# EasyEDA schematic SCH_8th-gen-Civic-Navigation-Screen-AIBT-Base.json

## Sheets
1 Power Inlet: TITLE: AIBT Base Power Inlet; REV: 1.0; Date: 2024-06-09; Sheet: 1/1; Drawn By: afranit; Company: Your Company
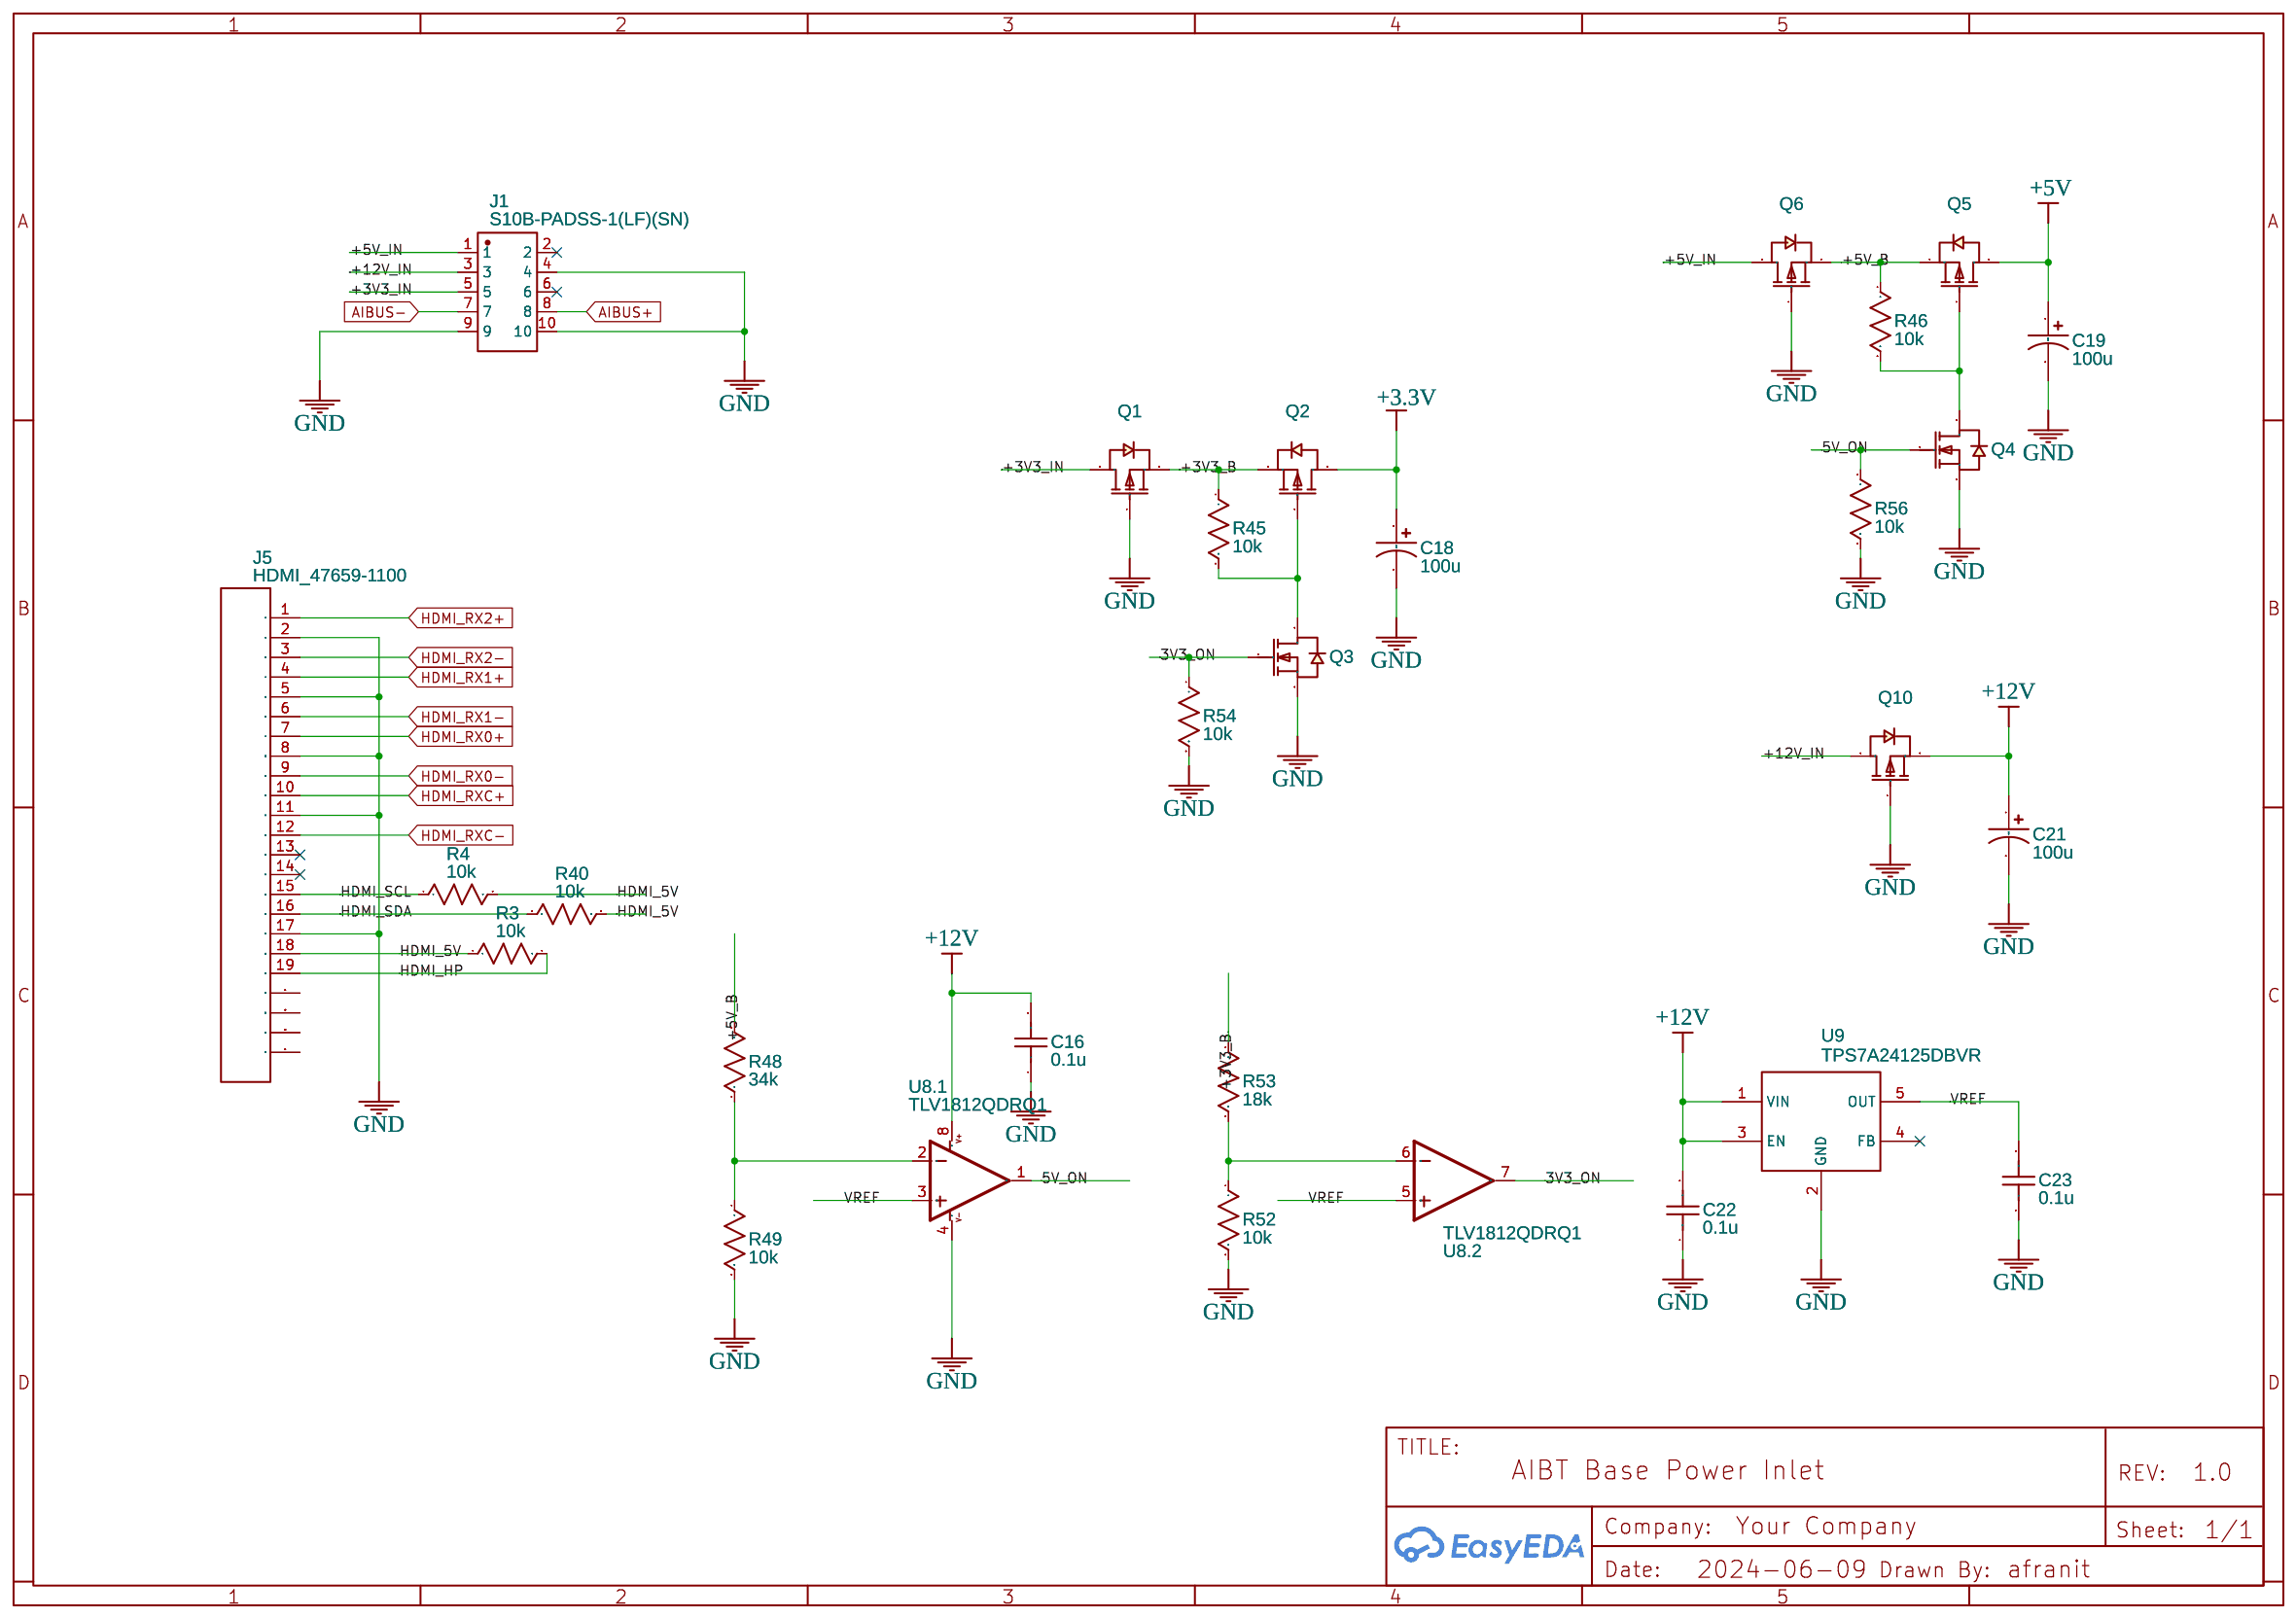
[diagram p0: Power Inlet]
2 Preregulator: TITLE: AIBT Base Preregulator; Date: 2024-07-02; Drawn By: Aidan C. Franits; Company: AidF Electronics
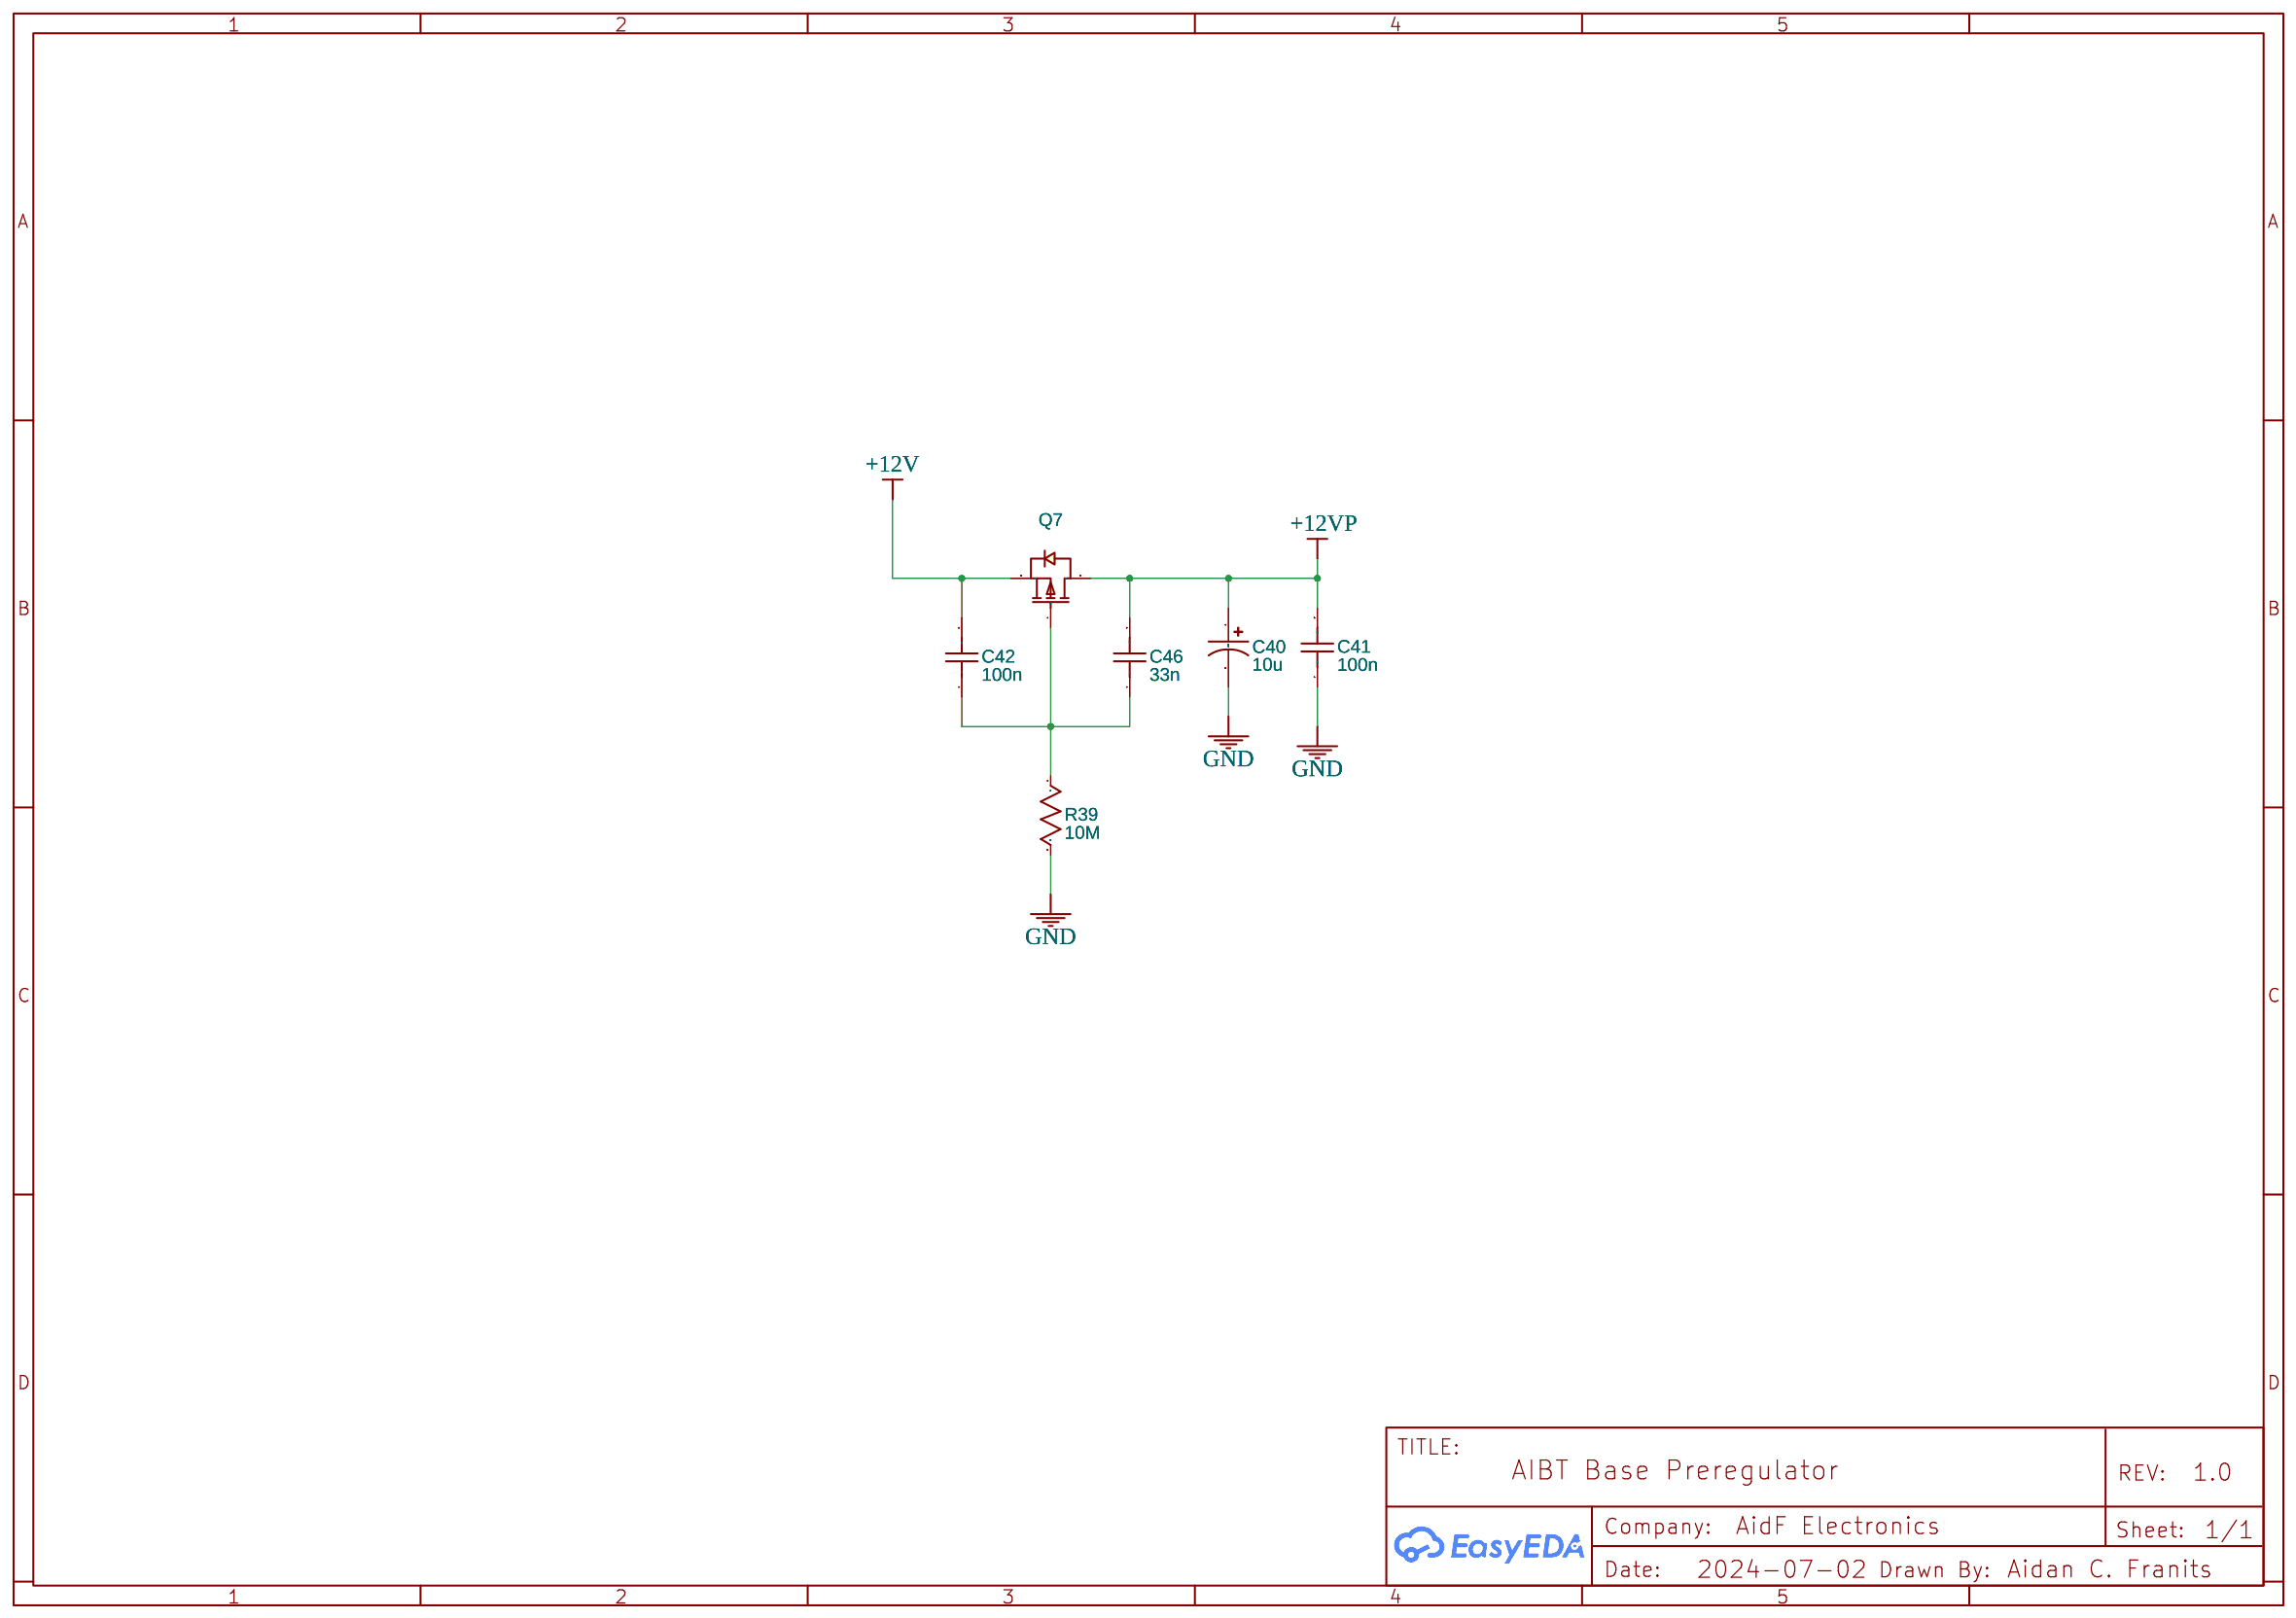
[diagram p1: Preregulator]
3 Power Conversion: TITLE: AIBT Base Power Conversion; Drawn By: Aidan C Franits; Company: AidF Electronics
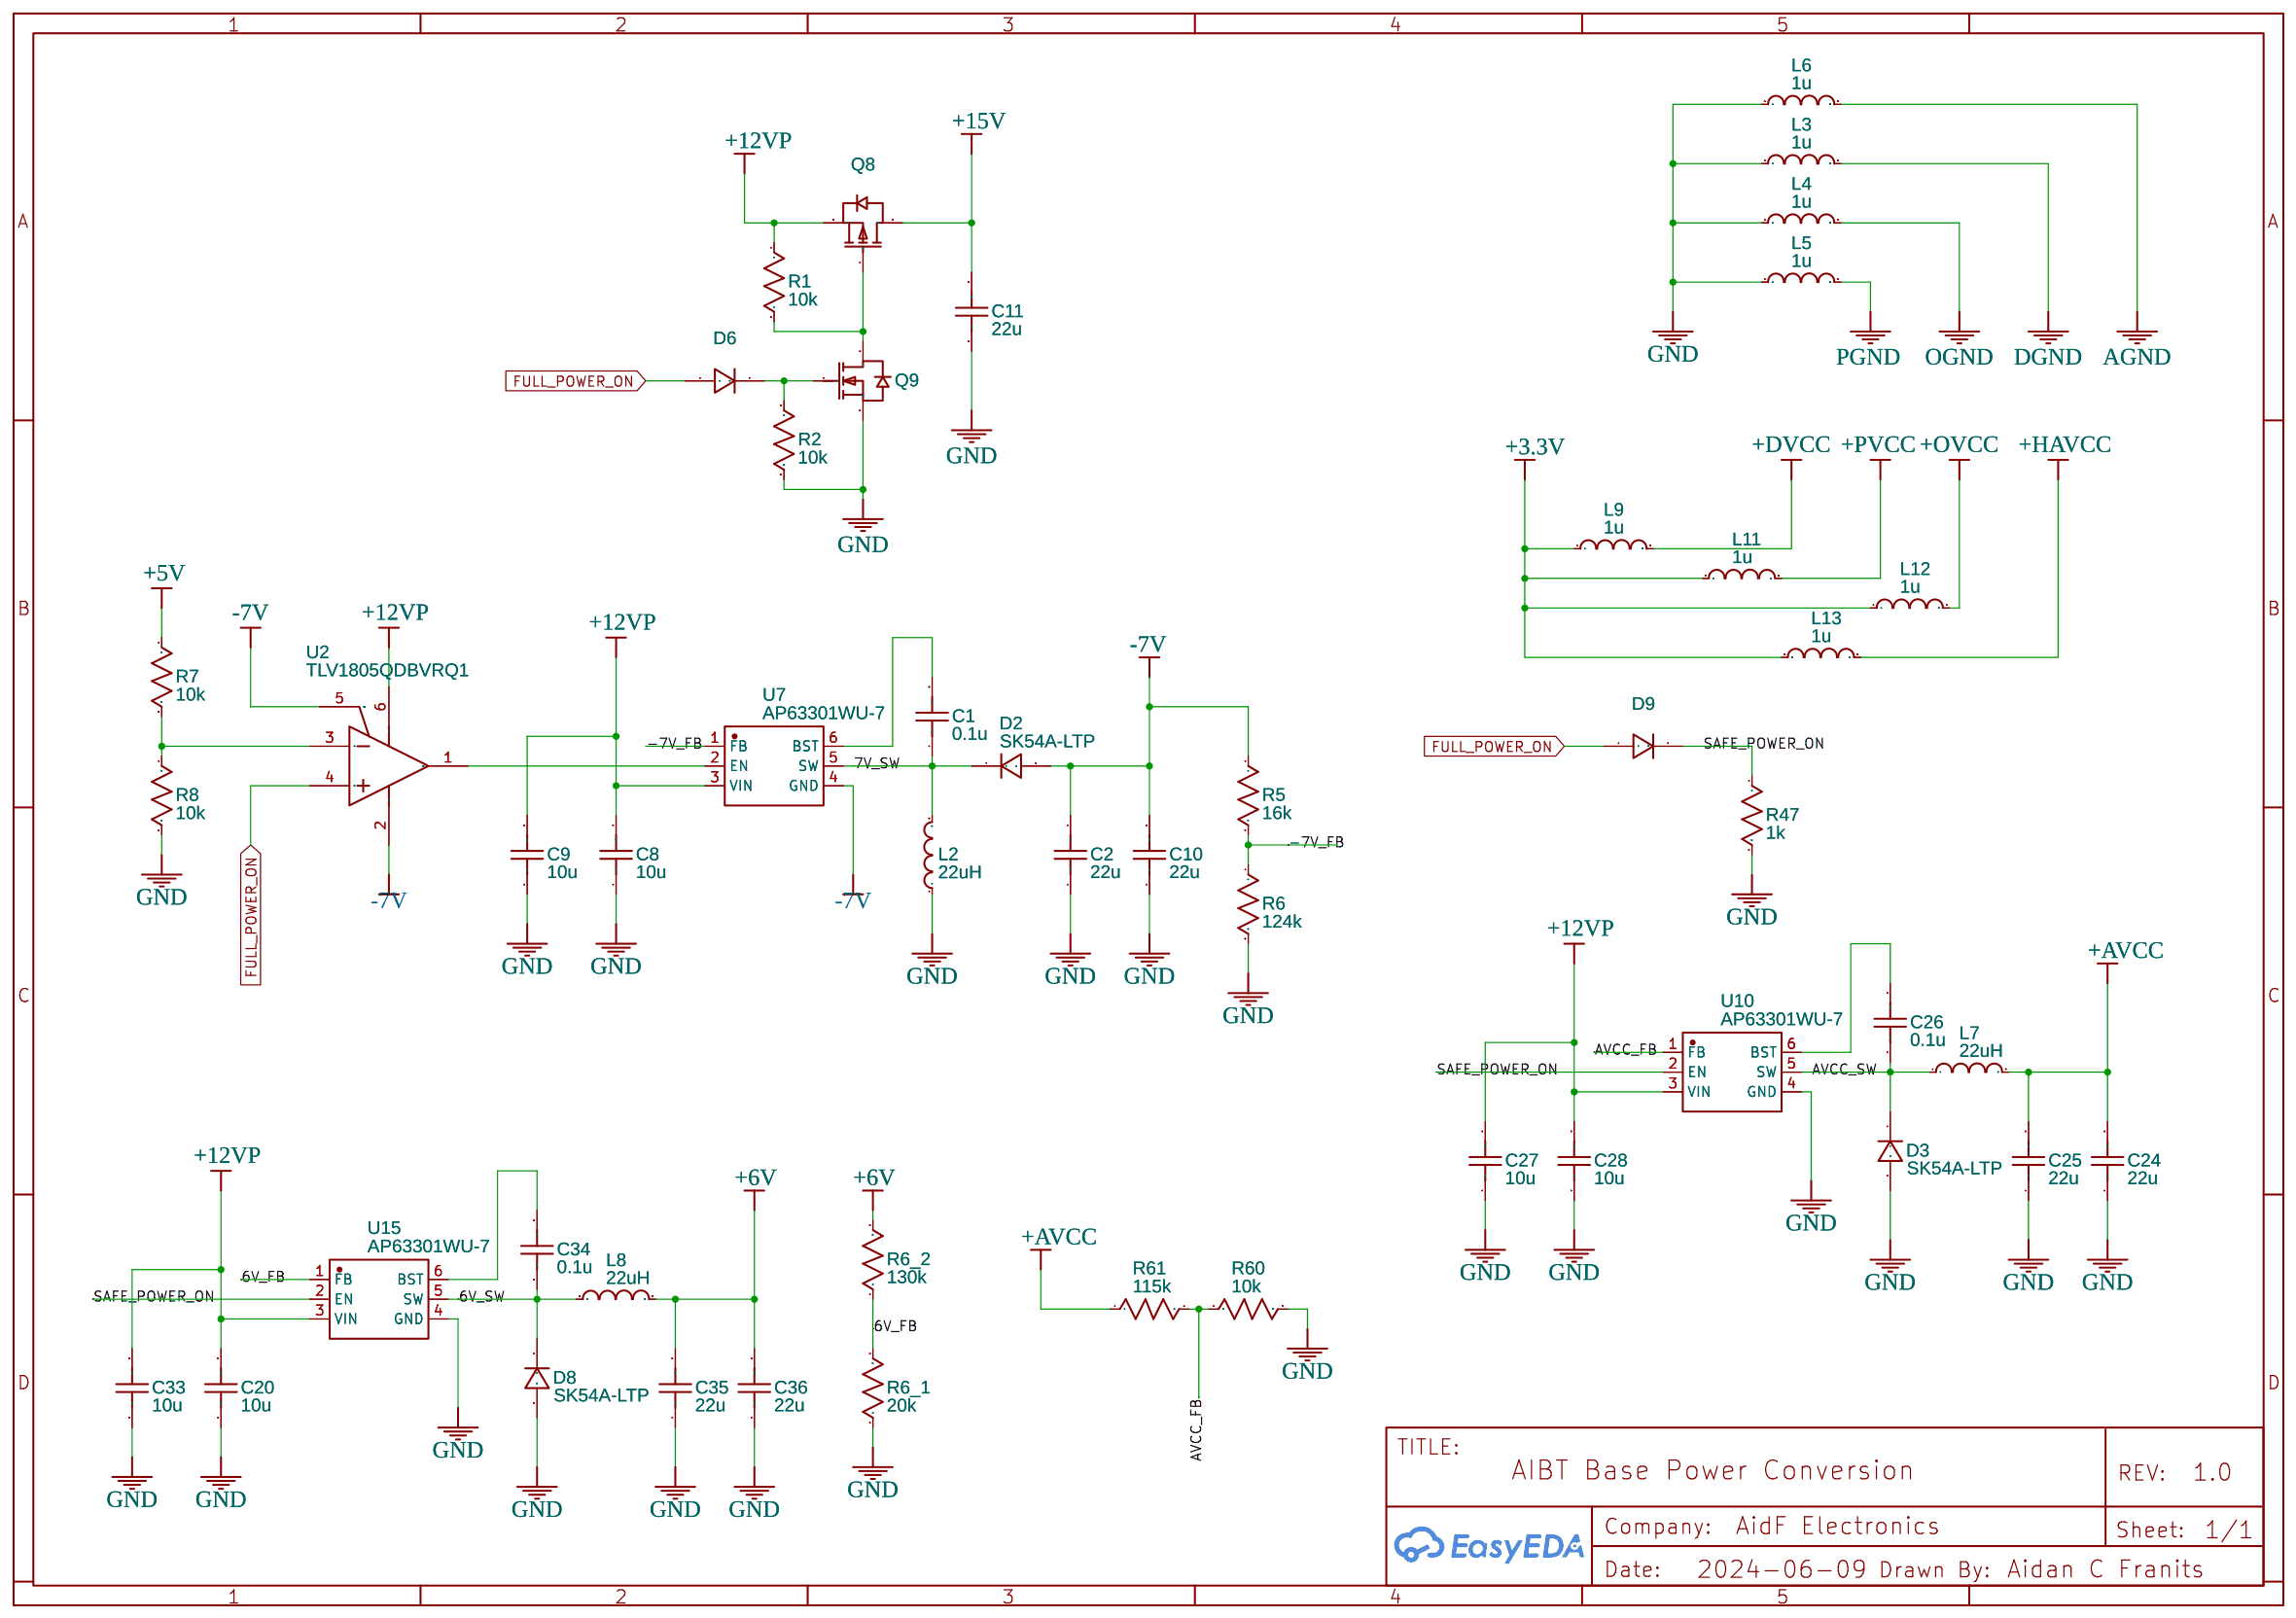
[diagram p2: Power Conversion]
4 Front Out: TITLE: AIBT Base Front Out; Drawn By: Aidan C Franits; Company: AidF Electronics
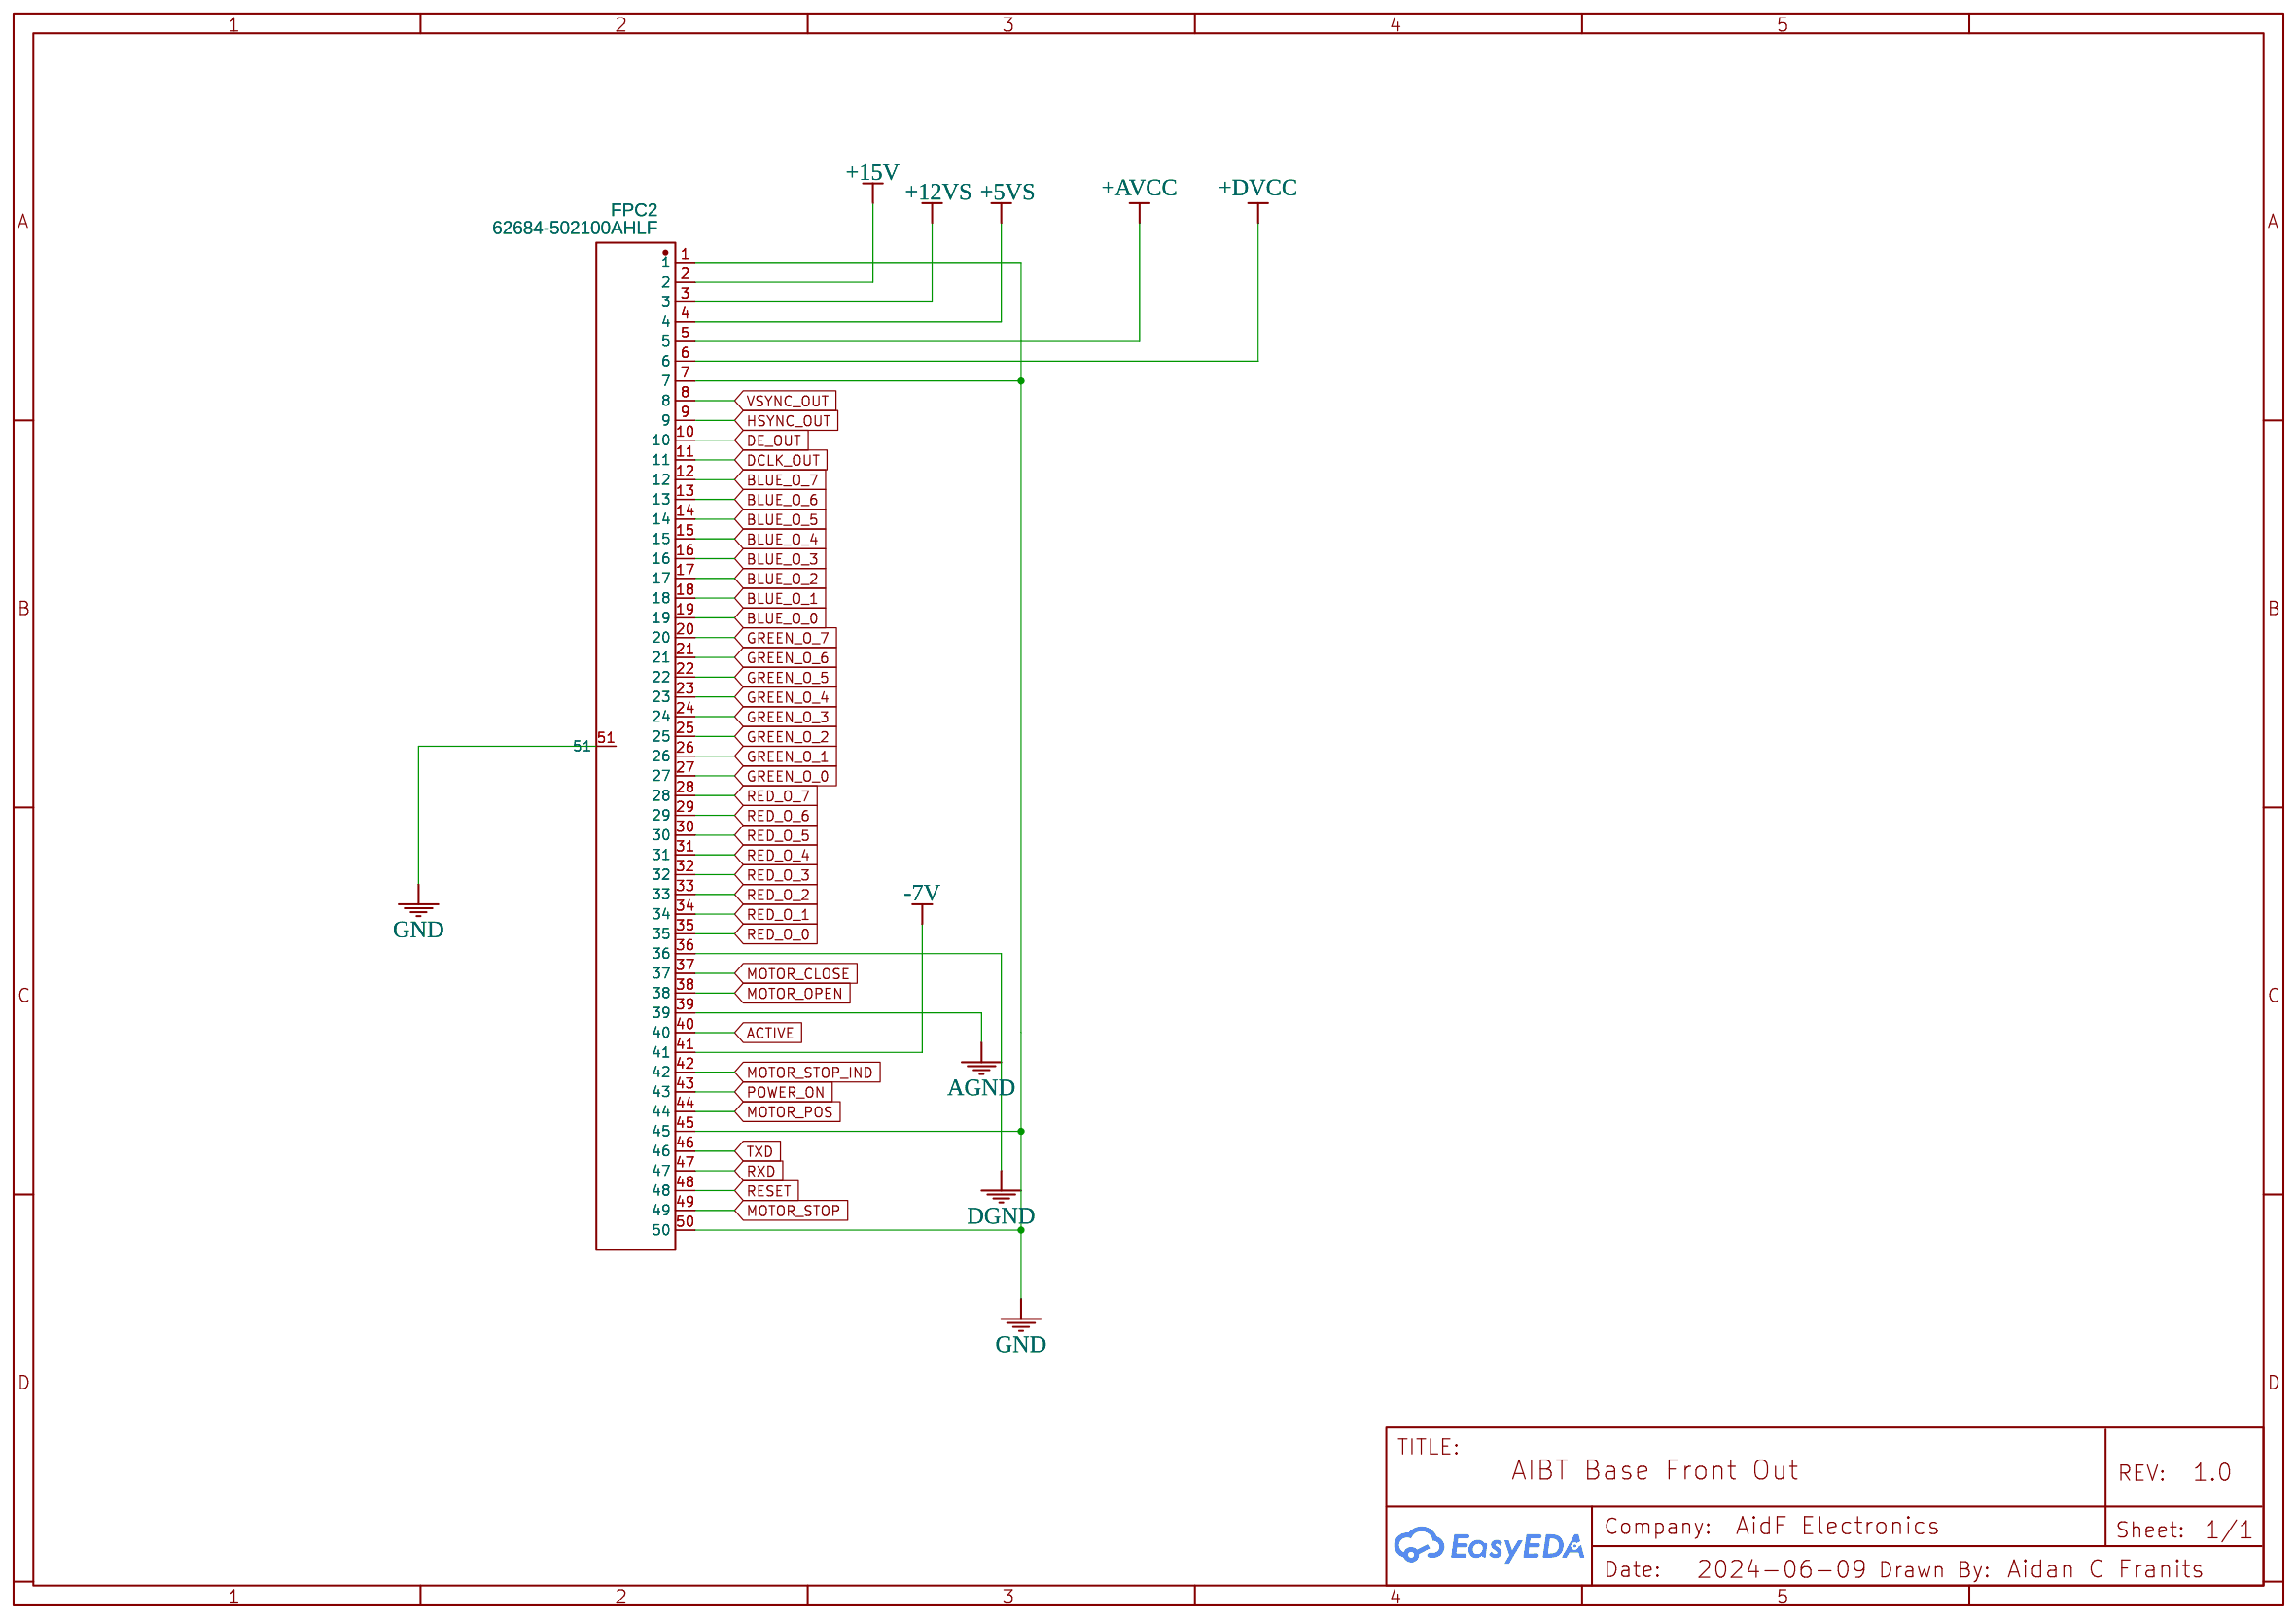
[diagram p3: Front Out]
5 HDMI Decoder: TITLE: HDMI Decoder; Drawn By: Aidan C Franits; Company: AidF Electronics
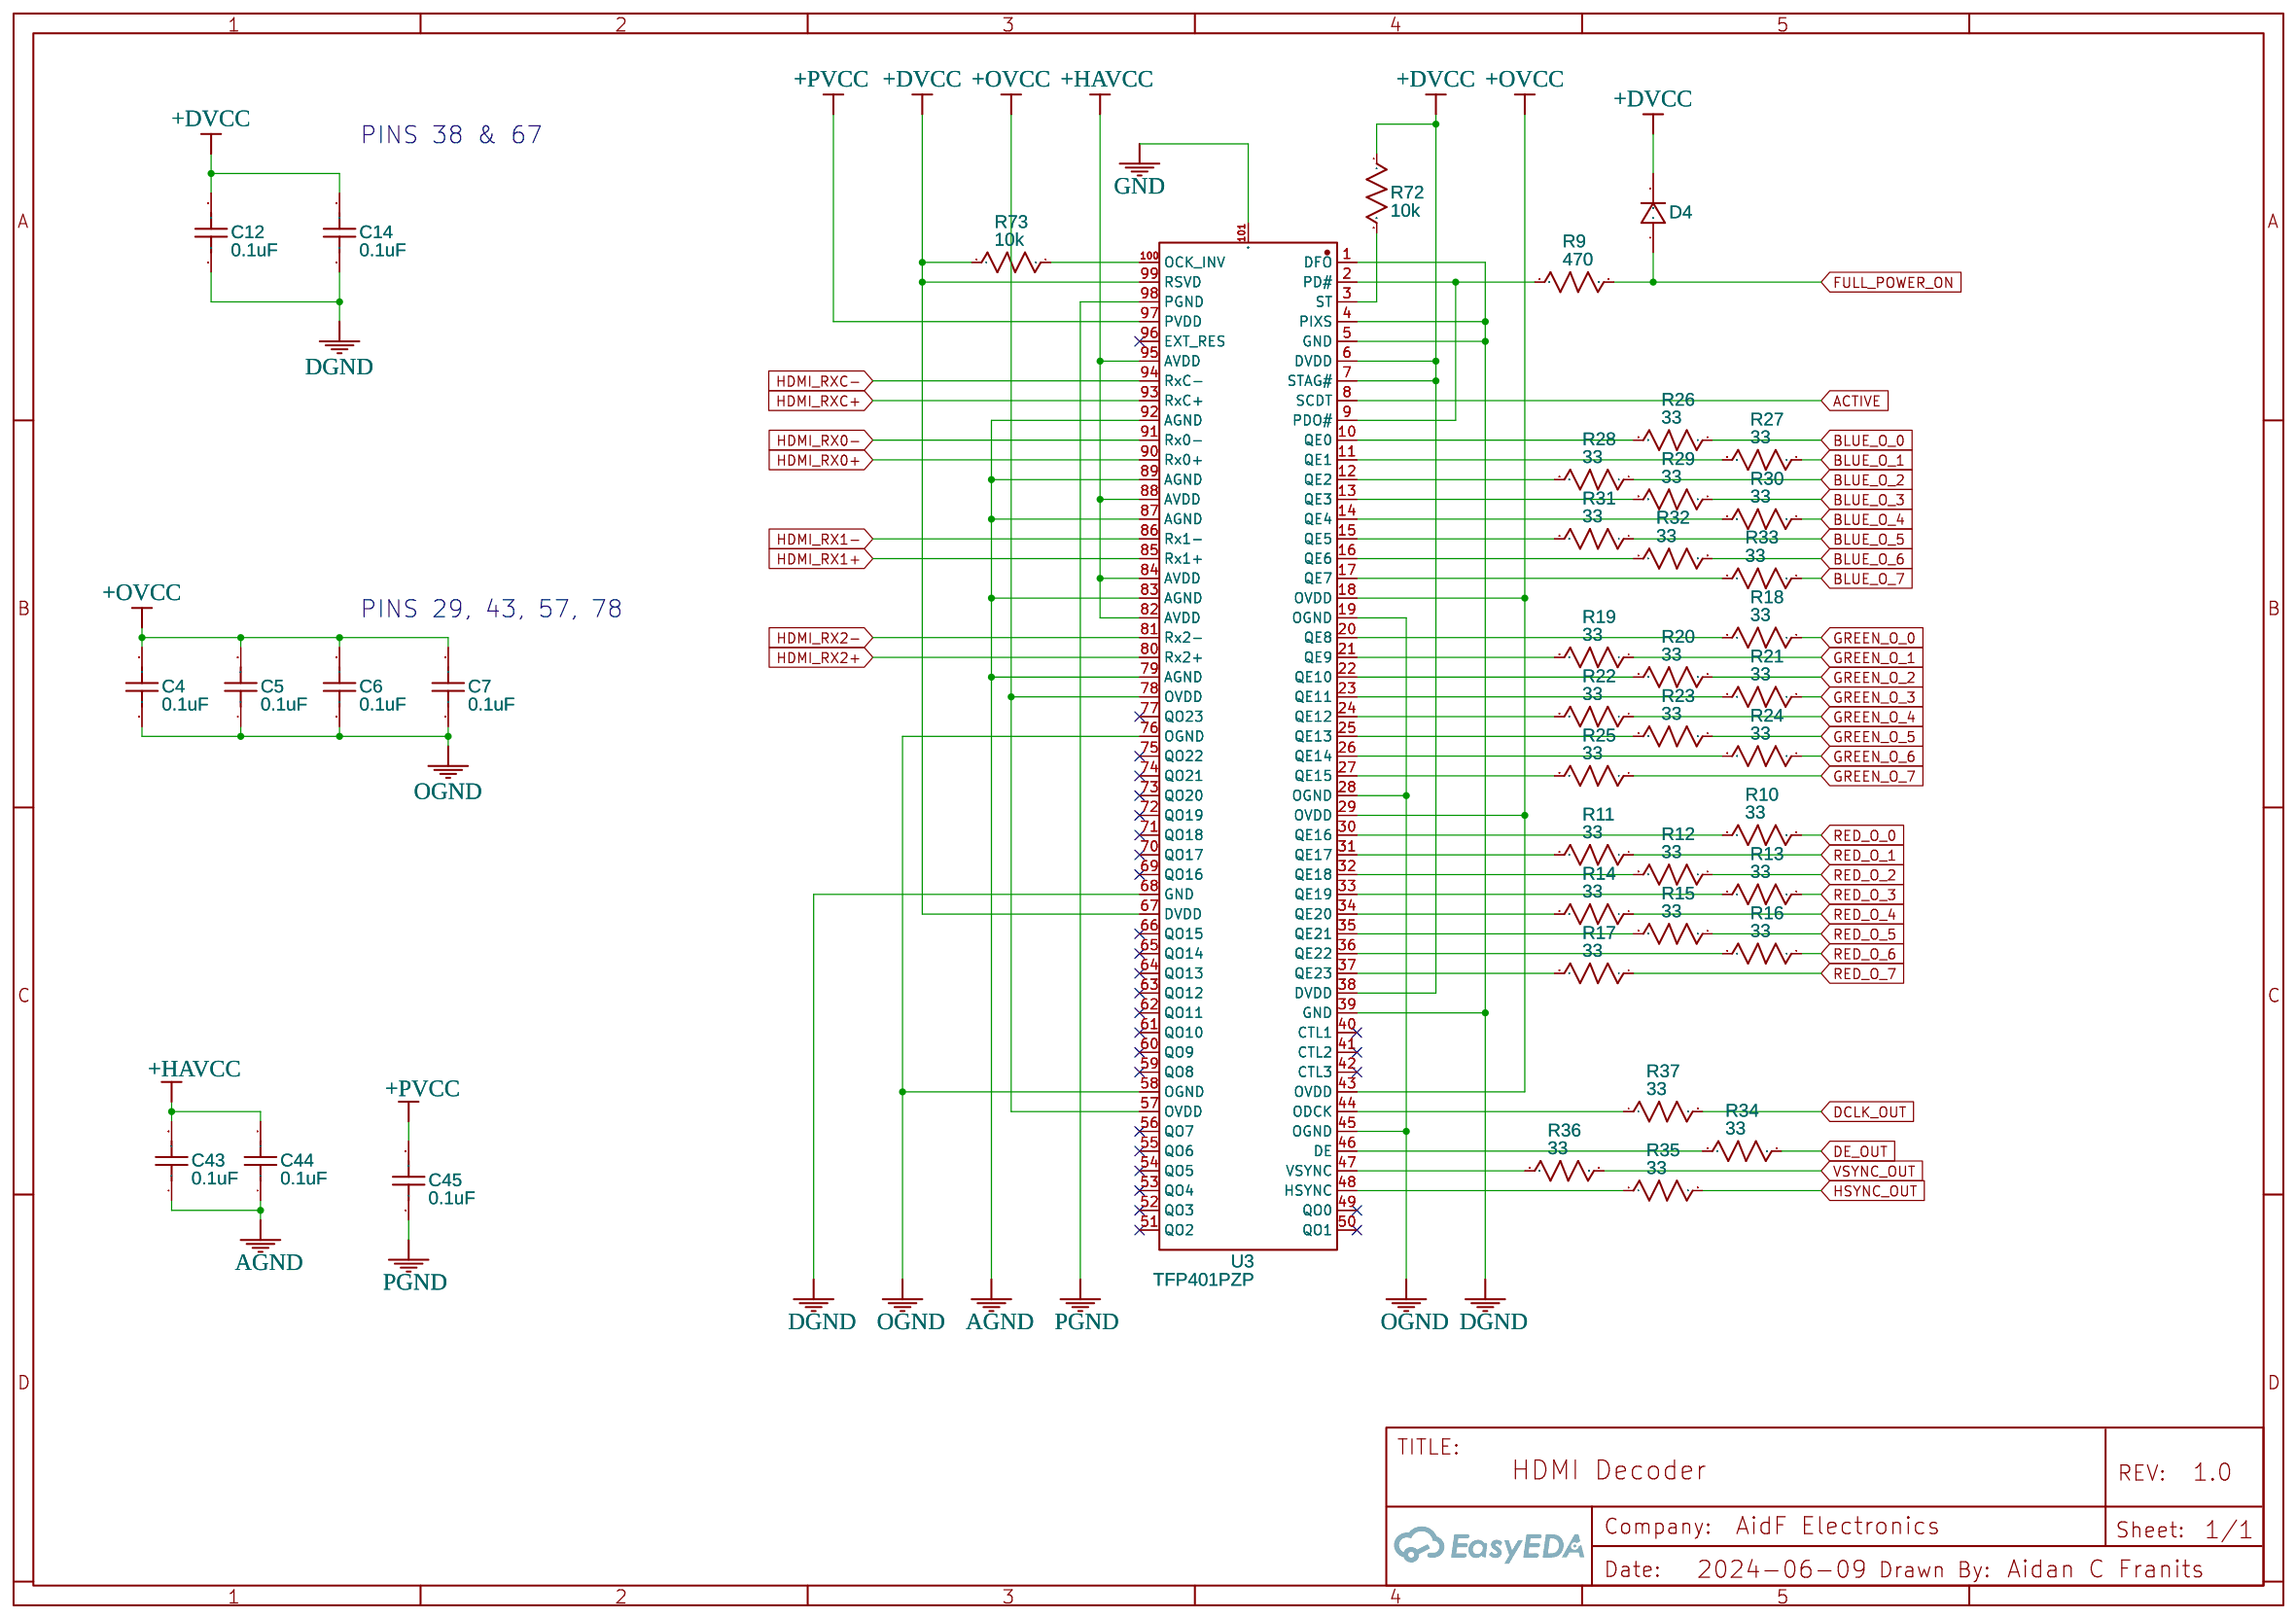
[diagram p4: HDMI Decoder]
6 AIBus Inlet: TITLE: AIBT Base AIBus Inlet; Drawn By: Aidan C Franits; Company: AidF Electronics
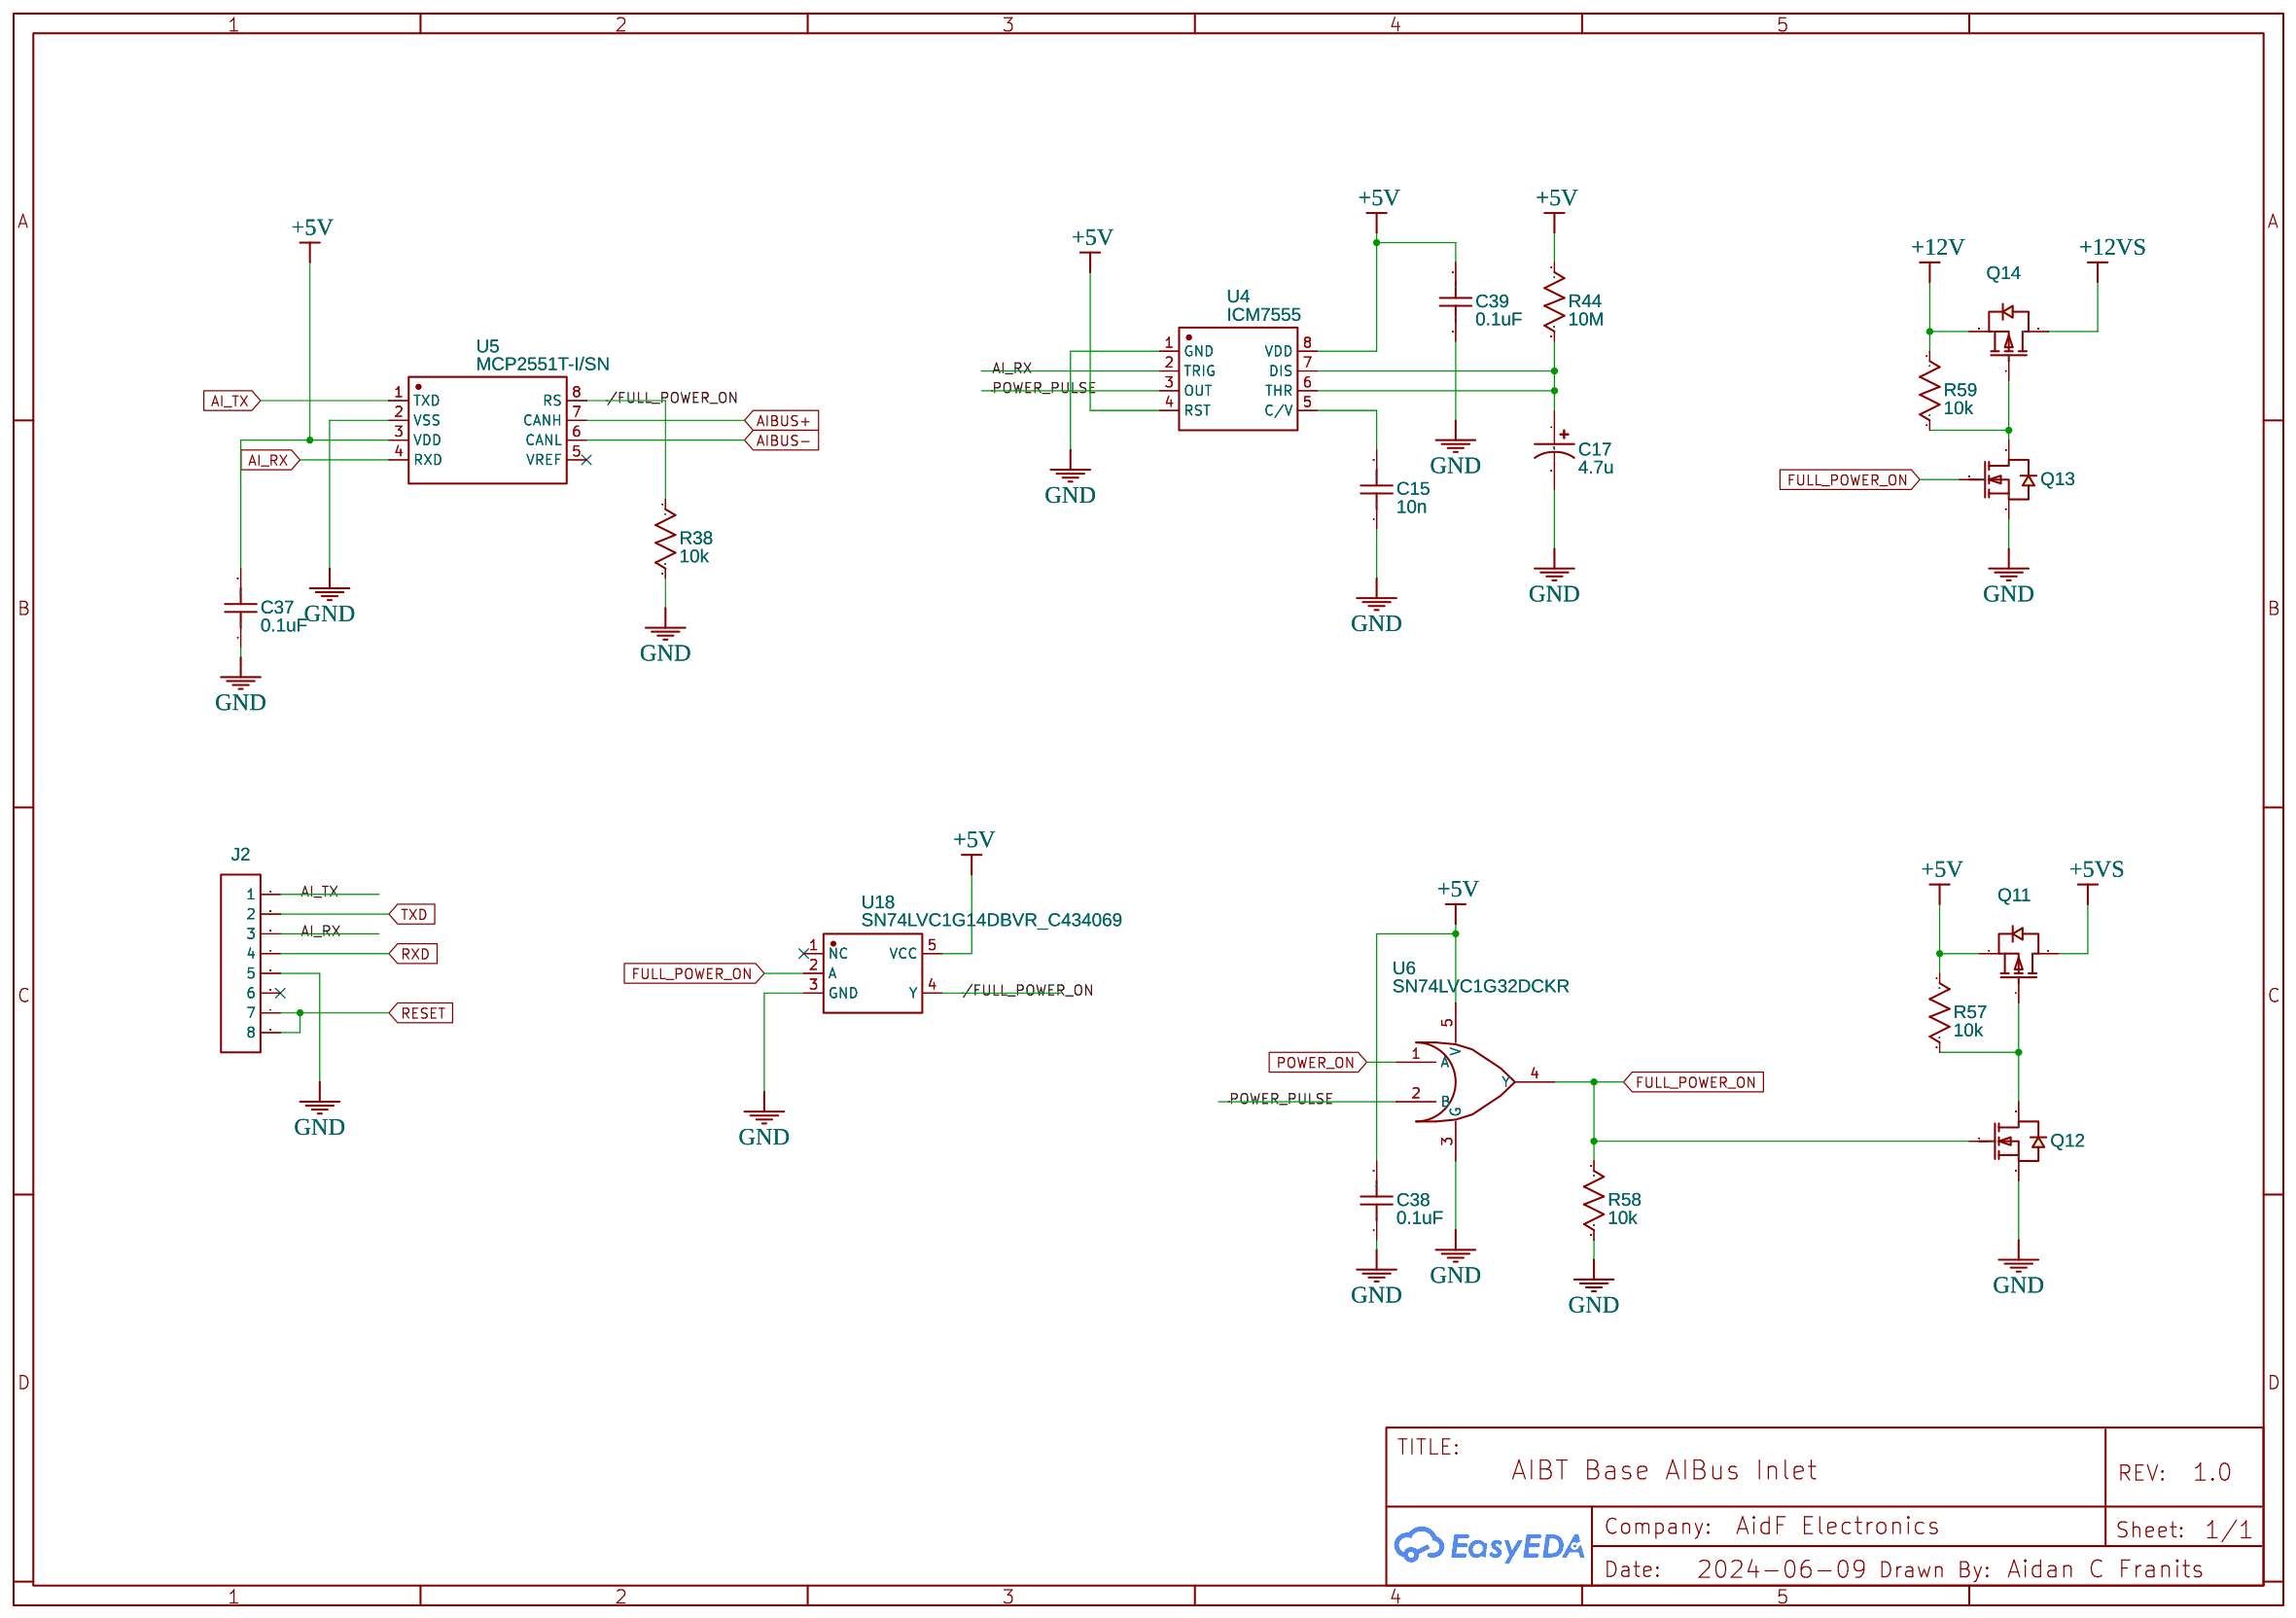
[diagram p5: AIBus Inlet]
7 Motor Control: TITLE: AIBT Base Motor Control; Date: 2024-06-21; Drawn By: Aidan C Franits; Company: AidF Electronics
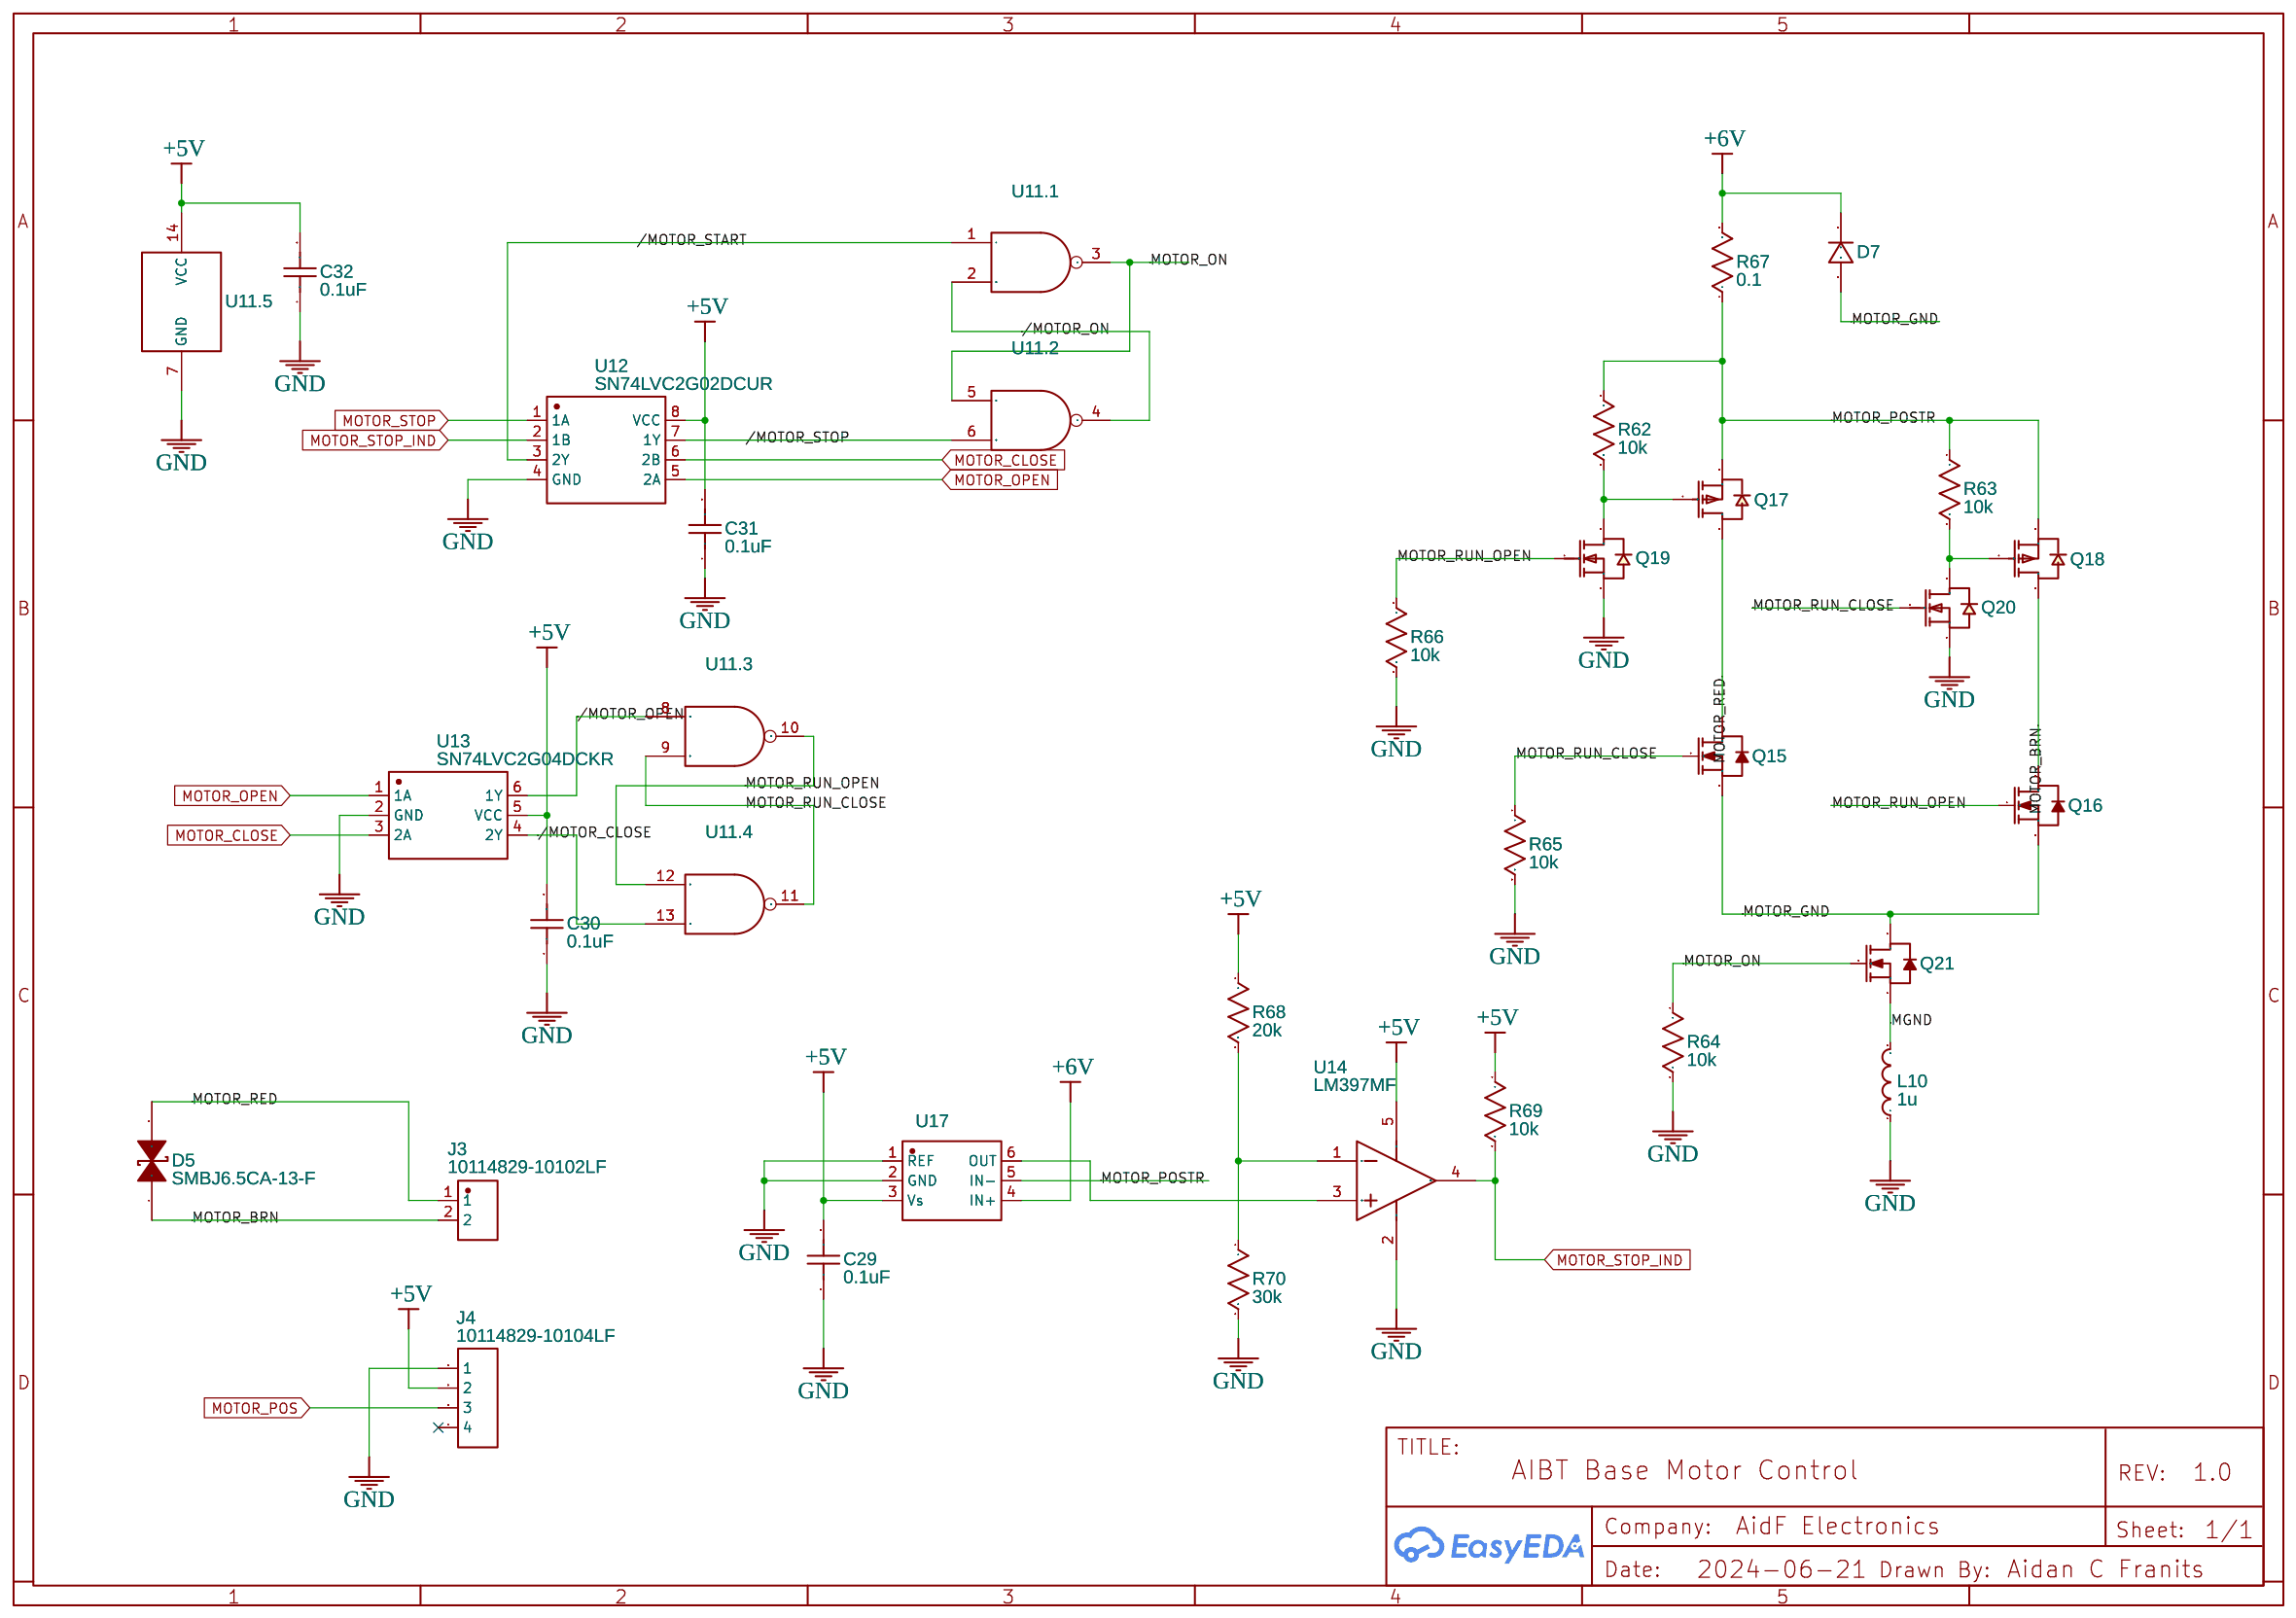
[diagram p6: Motor Control]

## Parts
sheet AIBus Inlet
C15  10n  [C0603]
C17  4.7u  [CAP-D5.0×F2.0]
C37  0.1uF  [C0603]
C38  0.1uF  [C0603]
C39  0.1uF  [C0603]
J2  HDR-M-2.54_1x8  [HDR-M-2.54_2X4]
Q11  SI2347DS-T1-GE3  [SOT-23-3_L2.9-W1.3-P1.83-LS2.4-BR-1]
Q12  DMN67D8LW-13  [SOT-323-3_L2.2-W1.3-P1.30-LS2.1-BR]
Q13  DMN67D8LW-13  [SOT-323-3_L2.2-W1.3-P1.30-LS2.1-BR]
Q14  SI2347DS-T1-GE3  [SOT-23-3_L2.9-W1.3-P1.83-LS2.4-BR-1]
R38  10k  [R0603]
R44  10M  [R0603]
R57  10k  [R0603]
R58  10k  [R0603]
R59  10k  [R0603]
U4  ICM7555  [SOIC-8]
U5  MCP2551T-I/SN  [SOIC-8_L4.9-W3.9-P1.27-LS6.0-BL-2]
U6  SN74LVC1G32DCKR  [SC-70-5_L2.1-W1.3-P0.65-LS2.1-BL]
U18  SN74LVC1G14DBVR_C434069  [SOT-23-5_L3.0-W1.7-P0.95-LS2.8-BR]
sheet Front Out
FPC2  62684-502100AHLF  [62684-502100AHLF]
sheet HDMI Decoder
C4  0.1uF  [C0603]
C5  0.1uF  [C0603]
C6  0.1uF  [C0603]
C7  0.1uF  [C0603]
C12  0.1uF  [C0603]
C14  0.1uF  [C0603]
C43  0.1uF  [C0603]
C44  0.1uF  [C0603]
C45  0.1uF  [C0603]
D4  SD103AWS-TP  [SOD-323_L1.8-W1.3-LS2.6-FD]
R9  470  [R0603]
R10  33  [R0603]
R11  33  [R0603]
R12  33  [R0603]
R13  33  [R0603]
R14  33  [R0603]
R15  33  [R0603]
R16  33  [R0603]
R17  33  [R0603]
R18  33  [R0603]
R19  33  [R0603]
R20  33  [R0603]
R21  33  [R0603]
R22  33  [R0603]
R23  33  [R0603]
R24  33  [R0603]
R25  33  [R0603]
R26  33  [R0603]
R27  33  [R0603]
R28  33  [R0603]
R29  33  [R0603]
R30  33  [R0603]
R31  33  [R0603]
R32  33  [R0603]
R33  33  [R0603]
R34  33  [R0603]
R35  33  [R0603]
R36  33  [R0603]
R37  33  [R0603]
R72  10k  [R0603]
R73  10k  [R0603]
U3  TFP401PZP  [HTQFP-100_L14.0-W14.0-P0.50-LS16.0-BL-EP5.2]
sheet Motor Control
C29  0.1uF  [C0603]
C30  0.1uF  [C0603]
C31  0.1uF  [C0603]
C32  0.1uF  [C0603]
D5  SMBJ6.5CA-13-F  [SMB_L4.3-W3.6-LS5.4-BI]
D7  S1G  [DO214AC]
J3  10114829-10102LF  [CONN-TH_2P-P1.25_10114829-10102LF]
J4  10114829-10104LF  [CONN-TH_4P-P1.25_10114829-10104LF]
L10  1u  [L0603]
Q15  DMG2302UK-7-ES  [SOT-23-3_L2.9-W1.3-P1.90-LS2.4-BR]
Q16  DMG2302UK-7-ES  [SOT-23-3_L2.9-W1.3-P1.90-LS2.4-BR]
Q17  SI2347DS-T1-GE3  [SOT-23-3_L2.9-W1.3-P1.83-LS2.4-BR-1]
Q18  SI2347DS-T1-GE3  [SOT-23-3_L2.9-W1.3-P1.83-LS2.4-BR-1]
Q19  DMN67D8LW-13  [SOT-323-3_L2.2-W1.3-P1.30-LS2.1-BR]
Q20  DMN67D8LW-13  [SOT-323-3_L2.2-W1.3-P1.30-LS2.1-BR]
Q21  DMG2302UK-7-ES  [SOT-23-3_L2.9-W1.3-P1.90-LS2.4-BR]
R62  10k  [R0603]
R63  10k  [R0603]
R64  10k  [R0603]
R65  10k  [R0603]
R66  10k  [R0603]
R67  0.1  [R0805]
R68  20k  [R0603]
R69  10k  [R0603]
R70  30k  [R0603]
U11  CD4011BM96  [SOIC-14_L8.7-W3.9-P1.27-LS6.0-BL]  (sections 1,2,3,4,5)
U12  SN74LVC2G02DCUR  [VSSOP-8_L2.3-W2.0-P0.50-LS3.1-BR]
U13  SN74LVC2G04DCKR  [SOT-363_L2.0-W1.3-P0.65-LS2.1-BR]
U14  LM397MF  [SOT-23-5_L2.9-W1.6-P0.95-LS2.8-BR]
U17  NCS214RSQT2G  [SC-70-6_L2.0-W1.3-P0.65-LS2.1-BL]
sheet Power Conversion
C1  0.1u  [C0603]
C2  22u  [C1210]
C8  10u  [C0805]
C9  10u  [C0805]
C10  22u  [C1210]
C11  22u  [C1210]
C20  10u  [C0805]
C24  22u  [C1210]
C25  22u  [C1210]
C26  0.1u  [C0603]
C27  10u  [C0805]
C28  10u  [C0805]
C33  10u  [C0805]
C34  0.1u  [C0603]
C35  22u  [C1210]
C36  22u  [C1210]
D2  SK54A-LTP  [DO-214AC_L4.3-W2.4-LS4.7-RD]
D3  SK54A-LTP  [DO-214AC_L4.3-W2.4-LS4.7-RD]
D6  SD103AWS-TP  [SOD-323_L1.8-W1.3-LS2.6-FD]
D8  SK54A-LTP  [DO-214AC_L4.3-W2.4-LS4.7-RD]
D9  SD103AWS-TP  [SOD-323_L1.8-W1.3-LS2.6-FD]
L2  22uH  [IND-SMD_L6.0-W6.0_ASPI-6045S]
L3  1u  [L0603]
L4  1u  [L0603]
L5  1u  [L0603]
L6  1u  [L0603]
L7  22uH  [IND-SMD_L6.0-W6.0_ASPI-6045S]
L8  22uH  [IND-SMD_L6.0-W6.0_ASPI-6045S]
L9  1u  [L0603]
L11  1u  [L0603]
L12  1u  [L0603]
L13  1u  [L0603]
Q8  SI2347DS-T1-GE3  [SOT-23-3_L2.9-W1.3-P1.83-LS2.4-BR-1]
Q9  DMN67D8LW-13  [SOT-323-3_L2.2-W1.3-P1.30-LS2.1-BR]
R1  10k  [R0603]
R2  10k  [R0603]
R5  16k  [R0603]
R6  124k  [R0603]
R6_1  20k  [R0603]
R6_2  130k  [R0603]
R7  10k  [R0603]
R8  10k  [R0603]
R47  1k  [R0603]
R60  10k  [R0603]
R61  115k  [R0603]
U2  TLV1805QDBVRQ1  [SOT-23-6_L2.9-W1.6-P0.95-LS2.8-BR]
U7  AP63301WU-7  [TSOT-23-6_L2.9-W1.6-P0.95-LS2.8-BR]
U10  AP63301WU-7  [TSOT-23-6_L2.9-W1.6-P0.95-LS2.8-BR]
U15  AP63301WU-7  [TSOT-23-6_L2.9-W1.6-P0.95-LS2.8-BR]
sheet Power Inlet
C16  0.1u  [C0603]
C18  100u  [CAP-D6.3×F2.5]
C19  100u  [CAP-D6.3×F2.5]
C21  100u  [CAP-D6.3×F2.5]
C22  0.1u  [C0603]
C23  0.1u  [C0603]
J1  S10B-PADSS-1(LF)(SN)  [CONN-TH_S10B-PADSS-1]
J5  HDMI_47659-1100  [2086581051]
Q1  SI2347DS-T1-GE3  [SOT-23-3_L2.9-W1.3-P1.83-LS2.4-BR-1]
Q2  SI2347DS-T1-GE3  [SOT-23-3_L2.9-W1.3-P1.83-LS2.4-BR-1]
Q3  DMN67D8LW-13  [SOT-323-3_L2.2-W1.3-P1.30-LS2.1-BR]
Q4  DMN67D8LW-13  [SOT-323-3_L2.2-W1.3-P1.30-LS2.1-BR]
Q5  SI2347DS-T1-GE3  [SOT-23-3_L2.9-W1.3-P1.83-LS2.4-BR-1]
Q6  SI2347DS-T1-GE3  [SOT-23-3_L2.9-W1.3-P1.83-LS2.4-BR-1]
Q10  SI2347DS-T1-GE3  [SOT-23-3_L2.9-W1.3-P1.83-LS2.4-BR-1]
R3  10k  [R0603]
R4  10k  [R0603]
R40  10k  [R0603]
R45  10k  [R0603]
R46  10k  [R0603]
R48  34k  [R0603]
R49  10k  [R0603]
R52  10k  [R0603]
R53  18k  [R0603]
R54  10k  [R0603]
R56  10k  [R0603]
U8  TLV1812QDRQ1  [SOIC-8_L4.9-W3.9-P1.27-LS5.9-BL]  (sections 1,2)
U9  TPS7A24125DBVR  [SOT-753_L3.1-W1.7-P0.95-LS3.0-BR]
sheet Preregulator
C40  10u  [CAP-D5.0-F2.0]
C41  100n  [C0603]
C42  100n  [C0603]
C46  33n  [C0603]
Q7  IRF5305PBF  [TO-220F-3_L10.2-W4.7-P2.54-L]
R39  10M  [R0603]

## Library data of the parts
C15 = C_0603_US: Supplier Part: 490-4781-1-ND; Supplier: Digi-Key; Contributor: LCEDA_Lib; Manufacturer Part: GCM188R72A103KA37D; Manufacturer: Murata Electronics
C17 = CE_TH_D5.0×F2.0_US: Supplier Part: 732-8818-1-ND; Supplier: Digi-Key; Contributor: LCEDA_Lib; Manufacturer Part: 860020472001; Manufacturer: Würth Elektronik
C4-C7 C12 C14 C29-C32 C37-C39 C43-C45 = C_0603_US: Supplier Part: 1292-1392-1-ND; Supplier: Digi-Key; Contributor: LCEDA_Lib; Manufacturer Part: 0603B104K101CT; Manufacturer: Walsin Technology Corporation
J2 = HDR-M-2.54_1x8: Supplier Part: SAM8996-ND; Supplier: Digi-Key; Manufacturer: Samtec Inc.; Manufacturer Part: TSW-104-07-F-D; Contributor: LCEDA_Lib
Q1 Q2 Q5 Q6 Q8 Q10 Q11 Q14 = IRF5210: Supplier: Digi-Key; Manufacturer: Vishay Siliconix; Supplier Part: SI2347DS-T1-GE3CT-ND; Contributor: LCEDA_Lib
Q3 Q4 Q9 Q12 Q13 Q19 Q20 = 2N7002: Supplier: Digi-Key; Manufacturer: Diodes Incorporated; Supplier Part: DMN67D8LW-13DICT-ND; Contributor: LCEDA_Lib
R1-R4 R7 R8 R38 R40 R45 R46 R49 R52 R54 R56-R60 R62-R66 R69 R72 R73 = R_0603_US: Supplier Part: RNCP0603FTD10K0CT-ND; Supplier: Digi-Key; Contributor: LCEDA_Lib; Manufacturer Part: RNCP0603FTD10K0; Manufacturer: Stackpole Electronics Inc
R44 = R_0603_US: Supplier Part: RMCF0603FT10M0CT-ND; Supplier: Digi-Key; Contributor: LCEDA_Lib; Manufacturer Part: RMCF0603FT10M0; Manufacturer: Stackpole Electronics Inc
U4 = ICM7555: Contributor: jonny0811; Manufacturer Part: ICM7555IBAZ-T; Supplier: Digi-Key; Supplier Part: ICM7555IBAZ-TCT-ND; Manufacturer: Renesas Electronics Corporation
U5 = MCP2551T-I/SN: Supplier: Digi-Key; Manufacturer: Microchip Technology; Manufacturer Part: MCP2551-I/SN; Supplier Part: MCP2551-I/SN-ND; JLCPCB Part Class: Extended Part
U6 = SN74LVC1G32DCKR: Manufacturer: Texas Instruments; Supplier Part: 296-9848-1-ND; Supplier: Digi-Key; Contributor: seabo2002
U18 = SN74LVC1G14DBVR_C434069: Contributor: LCSC; Supplier: LCSC; Supplier Part: C434069; Manufacturer: UMW(友台半导体); Manufacturer Part: SN74LVC1G14DBVR; JLCPCB Part Class: Extended Part
FPC2 = 5-1734839-0: Contributor: lcsc; Supplier: Digi-Key; Supplier Part: 609-62684-502100AHLFCT-ND; Manufacturer: Amphenol ICC (FCI); JLCPCB Part Class: Extended Part
D4 D6 D9 = 1N4148: Supplier: Digi-Key; Supplier Part: SD103AWSTPMSCT-ND; Manufacturer: Micro Commercial Co; Contributor: LCSC
R9 = R_0603_US: Supplier Part: 311-470GRCT-ND; Supplier: Digi-Key; Contributor: LCEDA_Lib; Manufacturer Part: RC0603JR-07470RL; Manufacturer: YAGEO
R10-R37 = R_0603_US: Supplier Part: 1292-WR06X330JTLCT-ND; Supplier: Digi-Key; Contributor: LCEDA_Lib; Manufacturer Part: WR06X330 JTL; Manufacturer: Walsin Technology Corporation
U3 = TFP401PZP: Contributor: LCSC; Supplier: Digi-Key; Supplier Part: 296-9992-ND; Manufacturer: Texas Instruments; JLCPCB Part Class: Extended Part; link: https://lcsc.com/eda_search?q=C2867606&%26type=1&ref=editor
D5 = SMBJ6.5CA-13-F: Contributor: LCSC; Supplier: Digi-Key; Manufacturer: Diodes Incorporated; Supplier Part: SMBJ6.5CA-FDICT-ND; JLCPCB Part Class: Extended Part
D7 = 1N4148: Supplier: Digi-Key; Supplier Part: 1655-S1GCT-ND; Manufacturer: SMC Diode Solutions; Contributor: LCSC
J3 = 10114829-10102LF: Contributor: LCSC; Supplier: Digi-Key; Supplier Part: 609-4383-1-ND; Manufacturer: Amphenol; JLCPCB Part Class: Extended Part
J4 = HDR-M-2.54_1x4: Supplier Part: 609-4385-1-ND; Supplier: Digi-Key; Manufacturer: Amphenol ICC (FCI); Contributor: LCEDA_Lib
L10 = L0603_US: Supplier Part: 490-BLM18SP102SN1DCT-ND; Supplier: Digi-Key; Contributor: LCEDA_Lib; Manufacturer Part: BLM18SP102SN1D; Manufacturer: Murata Electronics
Q15 Q16 Q21 = DMG2302UK-7-ES: Contributor: lcsc; Supplier: Digi-Key; Supplier Part: DMG2302UK-7DICT-ND; Manufacturer: Diodes Incorporated; Manufacturer Part: DMG2302UK-7; JLCPCB Part Class: Extended Part
Q17 Q18 = IRF5210: Supplier: Digi-Key; Manufacturer: Diodes Incorporated; Manufacturer Part: DMP2123L-7; Supplier Part: DMP2123LDICT-ND; Contributor: LCEDA_Lib
R67 = R_0603_US: Supplier Part: 273-KDV08DR100ETCT-ND; Supplier: Digi-Key; Contributor: LCEDA_Lib; Manufacturer Part: KDV08DR100ET; Manufacturer: Ohmite
R68 = R_0603_US: Supplier Part: A140451CT-ND; Supplier: Digi-Key; Contributor: LCEDA_Lib; Manufacturer Part: RQ73C1J20KBTD; Manufacturer: TE Connectivity Passive Product
R70 = R_0603_US: Supplier Part: RR08P30.0KDCT-ND; Supplier: Digi-Key; Contributor: LCEDA_Lib; Manufacturer Part: RR0816P-303-D; Manufacturer: Susumu
U11 = CD4011BM96: Manufacturer: Texas Instruments; Supplier: Digi-Key; Supplier Part: 296-14474-1-ND; Contributor: Glenny; subpart_no: 1
U12 = SN74LVC2G02DCUR: Supplier: Digi-Key; Manufacturer: Texas Instruments; Supplier Part: 296-13260-1-ND; JLCPCB Part Class: Extended Part
U13 = SN74LVC2G04DCKR: Supplier: Digi-Key; Manufacturer: Texas Instruments; Supplier Part: 296-13262-1-ND; JLCPCB Part Class: Extended Part
U14 = LM397MF: Supplier: Digi-Key; Supplier Part: LM397MF/NOPBCT-ND; Manufacturer: Texas Instruments; Contributor: LCSC
U17 = NCS214RSQT2G: Supplier: Digi-Key; Supplier Part: NCS214RSQT2GOSCT-ND; Manufacturer: onsemi; Contributor: LCSC; JLCPCB Part Class: Extended Part
C1 C16 C22 C23 C26 C34 C41 C42 = C_0603_US: Supplier Part: 478-5778-1-ND; Supplier: Digi-Key; Contributor: LCEDA_Lib; Manufacturer Part: 06035C104JAT2A; Manufacturer: KYOCERA AVX
C2 C10 C11 C24 C25 C35 C36 = C_0603_US: Supplier Part: 1276-3391-1-ND; Supplier: Digi-Key; Contributor: LCEDA_Lib; Manufacturer Part: CL32B226KAJNFNE; Manufacturer: Samsung Electro-Mechanics
C8 C9 C20 C27 C28 C33 = C_0603_US: Supplier Part: 1276-6454-1-ND; Supplier: Digi-Key; Contributor: LCEDA_Lib; Manufacturer Part: CL21A106KAYNNNG; Manufacturer: Samsung Electro-Mechanics
D2 D3 D8 = 1N4148: Supplier: Digi-Key; Supplier Part: SK54A-LTPMSCT-ND; Manufacturer: Micro Commercial Co; Contributor: LCSC
L2 L7 L8 = ASPI-6045S-220M-T: Contributor: LCSC; Supplier: Digi-Key; Supplier Part: 535-ASPI-6045S-220M-TCT-ND; Manufacturer: Abracon LLC; JLCPCB Part Class: Extended Part
L3-L6 L9 L11-L13 = L0603_US: Supplier Part: 490-5227-1-ND; Supplier: Digi-Key; Contributor: LCEDA_Lib; Manufacturer Part: BLM18RK601SN1D; Manufacturer: Murata Electronics
R5 = R_0603_US: Supplier Part: 311-16.0KHRCT-ND; Supplier: Digi-Key; Contributor: LCEDA_Lib; Manufacturer Part: RC0603FR-0716KL; Manufacturer: YAGEO
R6 = R_0603_US: Supplier Part: 311-124KHRCT-ND; Supplier: Digi-Key; Contributor: LCEDA_Lib; Manufacturer Part: RC0603FR-07124KL; Manufacturer: YAGEO
R6_1 = R_0603_US: Supplier Part: YAG1582CT-ND; Supplier: Digi-Key; Contributor: LCEDA_Lib; Manufacturer Part: RT0603BRD0720KL; Manufacturer: YAGEO
R6_2 = R_0603_US: Supplier Part: YAG1521CT-ND; Supplier: Digi-Key; Contributor: LCEDA_Lib; Manufacturer Part: RT0603BRD07130KL; Manufacturer: YAGEO
R47 = R_0603_US: Supplier Part: 311-1.00KHRCT-ND; Supplier: Digi-Key; Contributor: LCEDA_Lib; Manufacturer Part: RC0603FR-071KL; Manufacturer: YAGEO
R61 = R_0603_US: Supplier Part: 311-115KHRCT-ND; Supplier: Digi-Key; Contributor: LCEDA_Lib; Manufacturer Part: RC0603FR-07115KL; Manufacturer: YAGEO
U2 = TLV1805QDBVRQ1: Contributor: LCSC; Supplier: Digi-Key; Supplier Part: 296-TLV1805QDBVRQ1CT-ND; Manufacturer: Texas Instruments; JLCPCB Part Class: Extended Part
U7 U10 U15 = AP63301WU-7: Supplier: Digi-Key; Manufacturer: DIODES(美台); link: https://atta.szlcsc.comnull; Contributor: lcsc; JLCPCB Part Class: Extended Part
C18 C19 C21 = CE_TH_D6.3×F2.5_US: Supplier Part: 399-6650-1-ND; Supplier: Digi-Key; Contributor: LCEDA_Lib; Manufacturer Part: ESK107M025AE3EA; Manufacturer: KEMET
J1 = S10B-PADSS-1(LF)(SN): Contributor: LCSC; Supplier: Digi-Key; Supplier Part: 455-S10B-PADSS-1-ND; Manufacturer: JST Sales America Inc.; Manufacturer Part: S10B-PADSS-1; JLCPCB Part Class: Extended Part
J5 = HDMI_47659-1100: Contributor: afftspiau; Supplier: Digi-Key; Supplier Part: 900-2086581051CT-ND; Manufacturer: Molex; link: https://www.molex.com/pdm_docs/sd/476591100_sd.pdf
R48 = R_0603_US: Supplier Part: 311-34.0KHRCT-ND; Supplier: Digi-Key; Contributor: LCEDA_Lib; Manufacturer Part: RC0603FR-0734KL; Manufacturer: YAGEO
R53 = R_0603_US: Supplier Part: 311-18KGRCT-ND; Supplier: Digi-Key; Contributor: LCEDA_Lib; Manufacturer Part: RC0603JR-0718KL; Manufacturer: YAGEO
U8 = LM393: Contributor: Firmansyah Putra Pratama; subpart_no: 1; Supplier: Digi-Key; Supplier Part: 296-TLV1812QDRQ1CT-ND; Manufacturer: Texas Instruments
U9 = -: Supplier: Digi-Key; Supplier Part: 296-TPS7A24125DBVRCT-ND; Manufacturer: Texas Instruments
C40 = C_Tan_SMD_A_US: Supplier Part: P10425CT-ND; Supplier: Digi-Key; Contributor: LCEDA_Lib; Manufacturer Part: ECA-1HM100I; Manufacturer: Panasonic Electronic Components
C46 = C_0603_US: Supplier Part: 490-8025-1-ND; Supplier: Digi-Key; Contributor: LCEDA_Lib; Manufacturer Part: GCM188R71H333KA55D; Manufacturer: Murata Electronics
Q7 = IRF5210: Supplier: Digi-Key; Manufacturer: Infineon Technologies; image: //image.lceda.cn/szlcsc/C2622.jpg; Supplier Part: IRF5305PBF-ND; Paste Type: expand; Contributor: LCEDA_Lib
R39 = R_0603_US: Supplier Part: 311-10.0MHRCT-ND; Supplier: Digi-Key; Contributor: LCEDA_Lib; Manufacturer Part: RC0603FR-0710ML; Manufacturer: YAGEO

## Nets
3V3_ON: Q3.1(G) R54.1 U8.7(OUT)
5V_ON: Q4.1(G) R56.1 U8.1(OUT)
6V_FB: R6_1.2 R6_2.1 U15.1(FB)
6V_SW: C34.1 D8.1 L8.1 U15.5(SW)
7V_SW: C1.1 D2.1 L2.2 U7.5(SW)
+3.3V: C18.1 L9.1 L11.1 L12.1 L13.1 Q2.3(D)
+3V3_B: Q1.2(S) Q2.2(S) R45.1 R53.1
+3V3_IN: J1.5 Q1.3(D)
+5V: C19.1 C29.2 C30.2 C31.2 C32.2 C37.2 C38.2 C39.2 J4.2 Q5.3(D) Q11.2(S) R7.1 R44.1 R57.1 R68.1 R69.1 U4.4(RST) U4.8(VDD) U5.3(VDD) U6.5(V) U11.14(VCC) U12.8(VCC) U13.5(VCC) U14.5(VS) U17.3(Vs) U18.5(VCC)
+5V_B: Q5.2(S) Q6.2(S) R46.1 R48.2
+5V_IN: J1.1 Q6.3(D)
+5VS: FPC2.4 Q11.3(D)
+6V: C35.2 C36.2 D7.2 L8.2 R6_2.2 R67.2 U17.4(IN+)
+12V: C16.2 C21.1 C22.2 C42.2 Q7.3(S) Q10.2(S) Q14.2(S) R59.1 U8.8(V+) U9.1(VIN) U9.3(EN)
+12V_IN: J1.3 Q10.3(D)
+12VP: C8.2 C9.2 C20.2 C27.2 C28.2 C33.2 C40.1 C41.2 C46.2 Q7.2(D) Q8.2(S) R1.1 U2.6(V+) U7.3(VIN) U10.3(VIN) U15.3(VIN)
+12VS: FPC2.3 Q14.3(D)
+15V: C11.2 FPC2.2 Q8.3(D)
+AVCC: C24.2 C25.2 FPC2.5 L7.2 R61.1
+DVCC: C12.2 C14.2 D4.2 FPC2.6 L9.2 R72.1 R73.1 U3.6(DVDD) U3.7(STAG#) U3.38(DVDD) U3.67(DVDD) U3.99(RSVD)
+PVCC: C45.2 L11.2 U3.97(PVDD)
-7V: C2.2 C10.2 D2.2 FPC2.41 R5.1 U2.2(V-) U2.5(SHDN) U7.4(GND)
-7V_FB: R5.2 R6.1 U7.1(FB)
AGND: C43.1 C44.1 FPC2.39 L6.2 U3.79(AGND) U3.83(AGND) U3.87(AGND) U3.89(AGND) U3.92(AGND)
AVCC_FB: R60.1 R61.2 U10.1(FB)
AVCC_SW: C26.1 D3.1 L7.1 U10.5(SW)
DGND: C12.1 C14.1 FPC2.36 L3.2 U3.1(DFO) U3.4(PIXS) U3.5(GND) U3.39(GND) U3.68(GND)
GND: C2.1 C8.1 C9.1 C10.1 C11.1 C15.1 C16.1 C17.2 C18.2 C19.2 C20.1 C21.2 C22.1 C23.1 C24.1 C25.1 C27.1 C28.1 C29.1 C30.1 C31.1 C32.1 C33.1 C35.1 C36.1 C37.1 C38.1 C39.1 C40.2 C41.1 D3.2 D8.2 FPC2.1 FPC2.7 FPC2.45 FPC2.50 FPC2.51 J1.4 J1.9 J1.10 J2.5 J4.1 J5.2 J5.5 J5.8 J5.11 J5.17 L2.1 L3.1 L4.1 L5.1 L6.1 L10.1 Q1.1(G) Q3.2(S) Q4.2(S) Q6.1(G) Q9.2(S) Q10.1(G) Q12.2(S) Q13.2(S) Q19.2(S) Q20.2(S) R2.2 R6.2 R6_1.1 R8.2 R38.2 R39.2 R47.2 R49.2 R52.2 R54.2 R56.2 R58.2 R60.2 R64.2 R65.2 R66.2 R70.2 U3.101(PAD) U4.1(GND) U5.2(VSS) U6.3(G) U8.4(V-) U9.2(GND) U10.4(GND) U11.7(GND) U12.4(GND) U13.2(GND) U14.2(GND) U15.4(GND) U17.1(REF) U17.2(GND) U18.3(GND)
PGND: C45.1 L5.2 U3.98(PGND)
+HAVCC: C43.2 C44.2 L13.2 U3.82(AVDD) U3.84(AVDD) U3.88(AVDD) U3.95(AVDD)
+OVCC: C4.2 C5.2 C6.2 C7.2 L12.2 U3.18(OVDD) U3.29(OVDD) U3.43(OVDD) U3.57(OVDD) U3.78(OVDD)
/FULL_POWER_ON: R38.1 U5.8(RS) U18.4(Y)
/MOTOR_CLOSE: U11.13 U13.4(2Y)
/MOTOR_ON: U11.2(B) U11.4
/MOTOR_OPEN: U11.8 U13.6(1Y)
/MOTOR_START: U11.1(A) U12.3(2Y)
/MOTOR_STOP: U11.6 U12.7(1Y)
ACTIVE: FPC2.40 U3.8(SCDT)
AI_RX: J2.3 U4.2(TRIG) U5.4(RXD)
AI_TX: J2.1 U5.1(TXD)
AIBUS+: J1.8 U5.7(CANH)
AIBUS-: J1.7 U5.6(CANL)
BLUE_O_0: FPC2.19 R26.1
BLUE_O_1: FPC2.18 R27.1
BLUE_O_2: FPC2.17 R28.1
BLUE_O_3: FPC2.16 R29.1
BLUE_O_4: FPC2.15 R30.1
BLUE_O_5: FPC2.14 R31.1
BLUE_O_6: FPC2.13 R32.2
BLUE_O_7: FPC2.12 R33.2
DCLK_OUT: FPC2.11 R37.2
DE_OUT: FPC2.10 R34.2
FULL_POWER_ON: D4.1 D6.1 D9.1 Q12.1(G) Q13.1(G) R9.2 R58.1 U2.4(+IN) U6.4(Y) U18.2(A)
GREEN_O_0: FPC2.27 R18.1
GREEN_O_1: FPC2.26 R19.1
GREEN_O_2: FPC2.25 R20.1
GREEN_O_3: FPC2.24 R21.1
GREEN_O_4: FPC2.23 R22.1
GREEN_O_5: FPC2.22 R23.1
GREEN_O_6: FPC2.21 R24.1
GREEN_O_7: FPC2.20 R25.1
HDMI_5V: J5.18 R3.1 R4.2 R40.2
HDMI_HP: J5.19 R3.2
HDMI_RX0+: J5.7 U3.90(Rx0+)
HDMI_RX0-: J5.9 U3.91(Rx0-)
HDMI_RX1+: J5.4 U3.85(Rx1+)
HDMI_RX1-: J5.6 U3.86(Rx1-)
HDMI_RX2+: J5.1 U3.80(Rx2+)
HDMI_RX2-: J5.3 U3.81(Rx2-)
HDMI_RXC+: J5.10 U3.93(RxC+)
HDMI_RXC-: J5.12 U3.94(RxC-)
HDMI_SCL: J5.15 R4.1
HDMI_SDA: J5.16 R40.1
HSYNC_OUT: FPC2.9 R35.2
MGND: L10.2 Q21.2(S)
MOTOR_BRN: D5.1 J3.2 Q16.3(D) Q18.3(D)
MOTOR_CLOSE: FPC2.37 U12.6(2B) U13.3(2A)
MOTOR_GND: D7.1 Q15.2(S) Q16.2(S) Q21.3(D)
MOTOR_ON: Q21.1(G) R64.1 U11.3(Y) U11.5
MOTOR_OPEN: FPC2.38 U12.5(2A) U13.1(1A)
MOTOR_POS: FPC2.44 J4.3
MOTOR_POSTR: Q17.2(S) Q18.2(S) R62.1 R63.1 R67.1 U17.5(IN-)
MOTOR_RED: D5.2 J3.1 Q15.3(D) Q17.3(D)
MOTOR_RUN_CLOSE: Q15.1(G) Q20.1(G) R65.1 U11.9 U11.11
MOTOR_RUN_OPEN: Q16.1(G) Q19.1(G) R66.1 U11.10 U11.12
MOTOR_STOP: FPC2.49 U12.1(1A)
MOTOR_STOP_IND: FPC2.42 R69.2 U12.2(1B) U14.4(OUTPUT)
OGND: C4.1 C5.1 C6.1 C7.1 L4.2 U3.19(OGND) U3.28(OGND) U3.45(OGND) U3.58(OGND) U3.76(OGND)
POWER_ON: FPC2.43 U6.1(A)
POWER_PULSE: U4.3(OUT) U6.2(B)
RED_O_0: FPC2.35 R10.2
RED_O_1: FPC2.34 R11.1
RED_O_2: FPC2.33 R12.1
RED_O_3: FPC2.32 R13.1
RED_O_4: FPC2.31 R14.1
RED_O_5: FPC2.30 R15.1
RED_O_6: FPC2.29 R16.1
RED_O_7: FPC2.28 R17.1
RESET: FPC2.48 J2.7 J2.8
RXD: FPC2.47 J2.4
SAFE_POWER_ON: D9.2 R47.1 U10.2(EN) U15.2(EN)
TXD: FPC2.46 J2.2
VREF: C23.2 U8.3(+IN) U8.5(+IN) U9.5(OUT)
VSYNC_OUT: FPC2.8 R36.2
Net-(C1-2): C1.2 U7.6(BST)
Net-(C15-2): C15.2 U4.5(C/V)
Net-(C17-1): C17.1 R44.2 U4.6(THR) U4.7(DIS)
Net-(C26-2): C26.2 U10.6(BST)
Net-(C34-2): C34.2 U15.6(BST)
Net-(C42-1): C42.1 C46.1 Q7.1(G) R39.1
Net-(D6-2): D6.2 Q9.1(G) R2.1
Net-(Q2-1): Q2.1(G) Q3.3(D) R45.2
Net-(Q4-3): Q4.3(D) Q5.1(G) R46.2
Net-(Q8-1): Q8.1(G) Q9.3(D) R1.2
Net-(Q11-1): Q11.1(G) Q12.3(D) R57.2
Net-(Q13-3): Q13.3(D) Q14.1(G) R59.2
Net-(Q17-1): Q17.1(G) Q19.3(D) R62.2
Net-(Q18-1): Q18.1(G) Q20.3(D) R63.2
Net-(R7-2): R7.2 R8.1 U2.3(-IN)
Net-(R9-1): R9.1 U3.2(PD#) U3.9(PDO#)
Net-(R10-1): R10.1 U3.30(QE16)
Net-(R11-2): R11.2 U3.31(QE17)
Net-(R12-2): R12.2 U3.32(QE18)
Net-(R13-2): R13.2 U3.33(QE19)
Net-(R14-2): R14.2 U3.34(QE20)
Net-(R15-2): R15.2 U3.35(QE21)
Net-(R16-2): R16.2 U3.36(QE22)
Net-(R17-2): R17.2 U3.37(QE23)
Net-(R18-2): R18.2 U3.20(QE8)
Net-(R19-2): R19.2 U3.21(QE9)
Net-(R20-2): R20.2 U3.22(QE10)
Net-(R21-2): R21.2 U3.23(QE11)
Net-(R22-2): R22.2 U3.24(QE12)
Net-(R23-2): R23.2 U3.25(QE13)
Net-(R24-2): R24.2 U3.26(QE14)
Net-(R25-2): R25.2 U3.27(QE15)
Net-(R26-2): R26.2 U3.10(QE0)
Net-(R27-2): R27.2 U3.11(QE1)
Net-(R28-2): R28.2 U3.12(QE2)
Net-(R29-2): R29.2 U3.13(QE3)
Net-(R30-2): R30.2 U3.14(QE4)
Net-(R31-2): R31.2 U3.15(QE5)
Net-(R32-1): R32.1 U3.16(QE6)
Net-(R33-1): R33.1 U3.17(QE7)
Net-(R34-1): R34.1 U3.46(DE)
Net-(R35-1): R35.1 U3.48(HSYNC)
Net-(R36-1): R36.1 U3.47(VSYNC)
Net-(R37-1): R37.1 U3.44(ODCK)
Net-(R48-1): R48.1 R49.1 U8.2(-IN)
Net-(R52-1): R52.1 R53.2 U8.6(-IN)
Net-(R68-2): R68.2 R70.1 U14.1(VIN–)
Net-(R72-2): R72.2 U3.3(ST)
Net-(R73-2): R73.2 U3.100(OCK_INV)
Net-(U2-1): U2.1(OUT) U7.2(EN)
Net-(U14-3): U14.3(VIN+) U17.6(OUT)

Not connected (* = marked no-connect by the designer): J1 2* 6*; J2 6*; J4 4*; J5 13* 14* MH1 MH2 MH3 MH4; U3 40(CTL1)* 41(CTL2)* 42(CTL3)* 49(QO0)* 50(QO1)* 51(QO2)* 52(QO3)* 53(QO4)* 54(QO5)* 55(QO6)* 56(QO7)* 59(QO8)* 60(QO9)* 61(QO10)* 62(QO11)* 63(QO12)* 64(QO13)* 65(QO14)* 66(QO15)* 69(QO16)* 70(QO17)* 71(QO18)* 72(QO19)* 73(QO20)* 74(QO21)* 75(QO22)* 77(QO23)* 96(EXT_RES)*; U5 5(VREF)*; U9 4(FB)*; U18 1(NC)*

## Notes on the sheets
sheet 5
- PINS 38 & 67
- PINS 29, 43, 57, 78
